# Altium project RK_MEGAPLATA.PrjPcb (part 2 of 9)

## Sheet RK3588_TYPE_C.SchDoc
size 594 x 420 mm; SheetNumber: 6; SheetTotal: 23
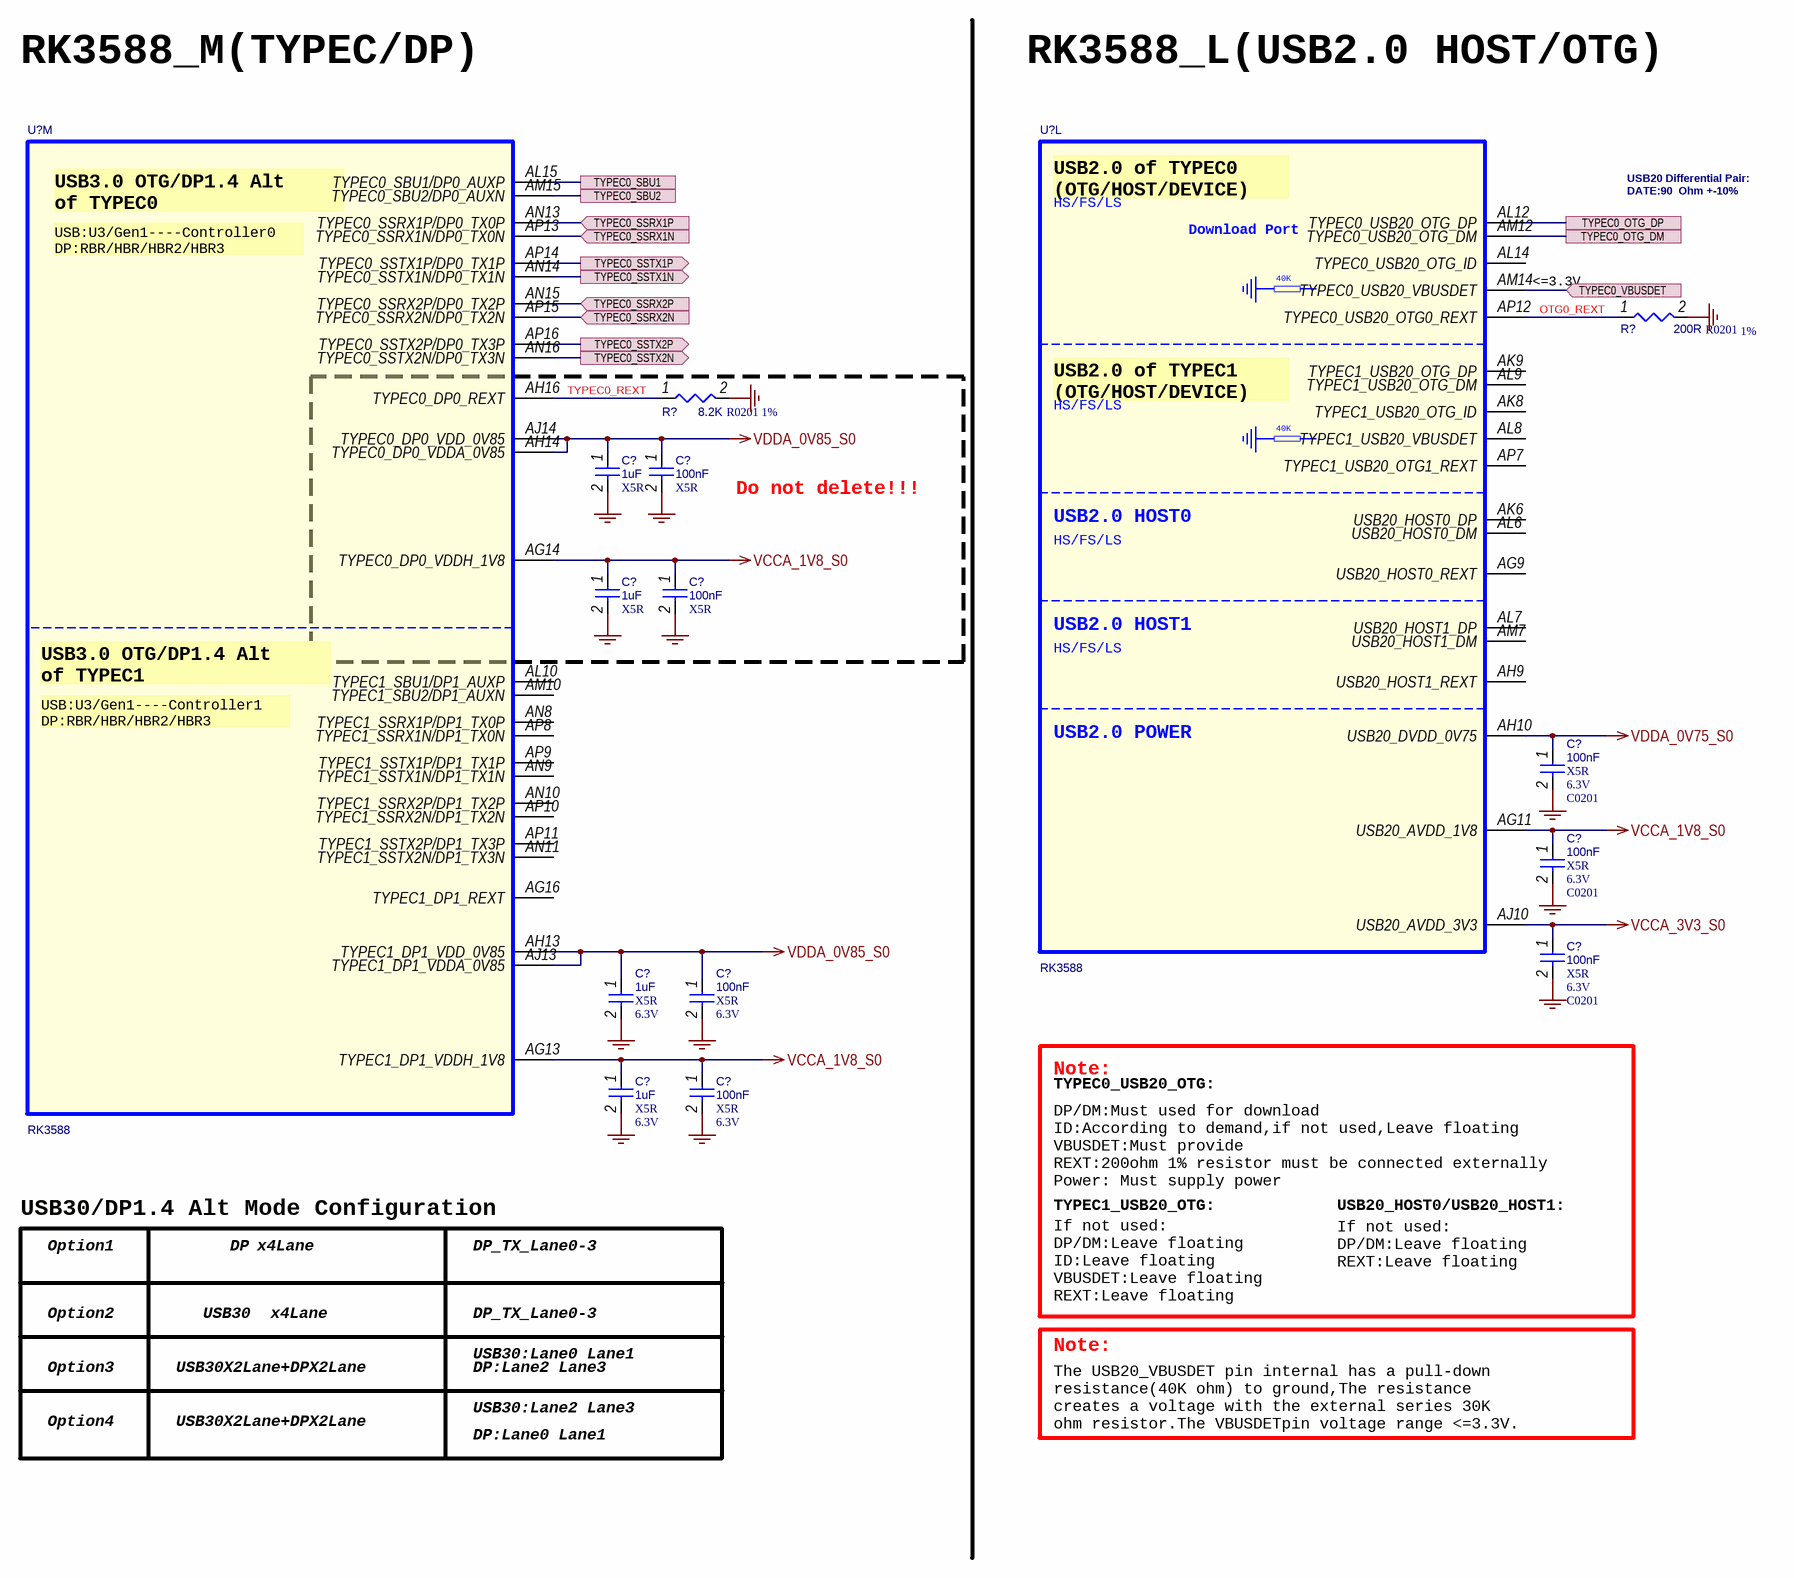
[diagram p7: RK3588_TYPE_C.SchDoc]

### Parts
(Parts that share a designator on the sheet are numbered #1, #2 ... from top to bottom, then left to right.)
C?#48  1uF  Dielectric: X5R  [C0201]
C?#49  100nF  Dielectric: X5R  [C0201]
C?#50  1uF  Dielectric: X5R  [C0201]
C?#51  100nF  Dielectric: X5R  [C0201]
C?#52  100nF  Dielectric: X5R  Voltage: 6.3V  [C0201]
C?#53  100nF  Dielectric: X5R  Voltage: 6.3V  [C0201]
C?#54  100nF  Dielectric: X5R  Voltage: 6.3V  [C0201]
C?#55  1uF  Dielectric: X5R  Voltage: 6.3V  [C0201]
C?#56  100nF  Dielectric: X5R  Voltage: 6.3V  [C0201]
C?#57  1uF  Dielectric: X5R  Voltage: 6.3V  [C0201]
C?#58  100nF  Dielectric: X5R  Voltage: 6.3V  [C0201]
R?#22  200R  Tolerance: 1%  PCB Footprint: R0201  [R0402]
R?#23  8.2K  Tolerance: 1%  PCB Footprint: R0201  [R0402]
U?#7  RK3588  [BGA1088_23R00X23R00X2R00]  (part M of 26)
U?#8  RK3588  [BGA1088_23R00X23R00X2R00]  (part L of 26)

### Blocks framed on the sheet
Do not delete!!!: C?#48-C?#51 R?#23 U?#7

### Ports
TYPEC0_OTG_DM (see PORT_TYPE_C[2B]), TYPEC0_OTG_DP (see PORT_TYPE_C[2B]), TYPEC0_SBU1 (see PORT_TYPE_C[2A]), TYPEC0_SBU2 (see PORT_TYPE_C[2B]), TYPEC0_SSRX1N (in, see PORT_TYPE_C[2B]), TYPEC0_SSRX1P (in, see PORT_TYPE_C[2B]), TYPEC0_SSRX2N (in, see PORT_TYPE_C[2B]), TYPEC0_SSRX2P (in, see PORT_TYPE_C[2B]), TYPEC0_SSTX1N (out, see PORT_TYPE_C[2B]), TYPEC0_SSTX1P (out, see PORT_TYPE_C[2B]), TYPEC0_SSTX2N (out, see PORT_TYPE_C[2B]), TYPEC0_SSTX2P (out, see PORT_TYPE_C[2B]), TYPEC0_VBUSDET (in, see PORT_TYPE_C[2C])

### Nets
GND: C?#48.2 C?#49.2 C?#50.2 C?#51.2 C?#52.2 C?#53.2 C?#54.2 C?#55.2 C?#56.2 C?#57.2 C?#58.2 R?#22.2 R?#23.2
VCCA_1V8_S0: C?#50.1 C?#51.1 C?#53.1 C?#57.1 C?#58.1 U?#7.AG13(TYPEC1_DP1_VDDH_1V8) U?#7.AG14(TYPEC0_DP0_VDDH_1V8) U?#8.AG11(USB20_AVDD_1V8)
VCCA_3V3_S0: C?#54.1 U?#8.AJ10(USB20_AVDD_3V3)
VDDA_0V75_S0: C?#52.1 U?#8.AH10(USB20_DVDD_0V75)
VDDA_0V85_S0: C?#48.1 C?#49.1 C?#55.1 C?#56.1 U?#7.AH13(TYPEC1_DP1_VDD_0V85) U?#7.AH14(TYPEC0_DP0_VDDA_0V85) U?#7.AJ13(TYPEC1_DP1_VDDA_0V85) U?#7.AJ14(TYPEC0_DP0_VDD_0V85)
OTG0_REXT: R?#22.1 U?#8.AP12(TYPEC0_USB20_OTG0_REXT)
TYPEC0_REXT: R?#23.1 U?#7.AH16(TYPEC0_DP0_REXT)
NetC?#185_1: U?#7.AL15(TYPEC0_SBU1/DP0_AUXP) ; port TYPEC0_SBU1
NetC?#186_1: U?#7.AM15(TYPEC0_SBU2/DP0_AUXN) ; port TYPEC0_SBU2
NetC?#187_1: U?#7.AN14(TYPEC0_SSTX1N/DP0_TX1N) ; port TYPEC0_SSTX1N
NetC?#188_1: U?#7.AP14(TYPEC0_SSTX1P/DP0_TX1P) ; port TYPEC0_SSTX1P
NetC?#189_1: U?#7.AN16(TYPEC0_SSTX2N/DP0_TX3N) ; port TYPEC0_SSTX2N
NetC?#190_1: U?#7.AP16(TYPEC0_SSTX2P/DP0_TX3P) ; port TYPEC0_SSTX2P
NetR?#73_1: U?#8.AM12(TYPEC0_USB20_OTG_DM) ; port TYPEC0_OTG_DM
NetR?#75_1: U?#8.AL12(TYPEC0_USB20_OTG_DP) ; port TYPEC0_OTG_DP
NetR?#77_1: U?#7.AP13(TYPEC0_SSRX1N/DP0_TX0N) ; port TYPEC0_SSRX1N
NetR?#78_1: U?#7.AN13(TYPEC0_SSRX1P/DP0_TX0P) ; port TYPEC0_SSRX1P
NetR?#79_1: U?#7.AP15(TYPEC0_SSRX2N/DP0_TX2N) ; port TYPEC0_SSRX2N
NetR?#80_1: U?#7.AN15(TYPEC0_SSRX2P/DP0_TX2P) ; port TYPEC0_SSRX2P
NetR?#81_1: U?#8.AM14(TYPEC0_USB20_VBUSDET) ; port TYPEC0_VBUSDET

Not connected (* = marked no-connect by the designer): U?#7 AG16(TYPEC1_DP1_REXT) AL10(TYPEC1_SBU1/DP1_AUXP) AM10(TYPEC1_SBU2/DP1_AUXN) AN8(TYPEC1_SSRX1P/DP1_TX0P) AN9(TYPEC1_SSTX1N/DP1_TX1N) AN10(TYPEC1_SSRX2P/DP1_TX2P) AN11(TYPEC1_SSTX2N/DP1_TX3N) AP8(TYPEC1_SSRX1N/DP1_TX0N) AP9(TYPEC1_SSTX1P/DP1_TX1P) AP10(TYPEC1_SSRX2N/DP1_TX2N) AP11(TYPEC1_SSTX2P/DP1_TX3P); U?#8 AG9(USB20_HOST0_REXT) AH9(USB20_HOST1_REXT) AK6(USB20_HOST0_DP) AK8(TYPEC1_USB20_OTG_ID) AK9(TYPEC1_USB20_OTG_DP) AL6(USB20_HOST0_DM) AL7(USB20_HOST1_DP) AL8(TYPEC1_USB20_VBUSDET) AL9(TYPEC1_USB20_OTG_DM) AL14(TYPEC0_USB20_OTG_ID) AM7(USB20_HOST1_DM) AP7(TYPEC1_USB20_OTG1_REXT)

### Notes on the sheet
- RK3588_M(TYPEC/DP)
- RK3588_L(USB2.0 HOST/OTG)
- USB20 Differential Pair:
  DATE:90  Ohm +-10%
- <=3.3V
- Note:
- TYPEC0_USB20_OTG:
- TYPEC1_USB20_OTG:
- DP/DM:Must used for download
  ID:According to demand,if not used,Leave floating
  VBUSDET:Must provide
  REXT:200ohm 1% resistor must be connected externally
  Power: Must supply power
- USB20_HOST0/USB20_HOST1:
- USB30/DP1.4 Alt Mode Configuration
- Option1
- DP
- x4Lane
- DP_TX_Lane0-3
- If not used:
  DP/DM:Leave floating
  REXT:Leave floating
- Option2
- USB30
- If not used:
  DP/DM:Leave floating
  ID:Leave floating
  VBUSDET:Leave floating
  REXT:Leave floating
- Option3
- USB30X2Lane+DPX2Lane
- USB30:Lane0 Lane1
- DP:Lane2 Lane3
- Option4
- USB30:Lane2 Lane3
- DP:Lane0 Lane1
- The USB20_VBUSDET pin internal has a pull-down
  resistance(40K ohm) to ground,The resistance
  creates a voltage with the external series 30K
  ohm resistor.The VBUSDETpin voltage range <=3.3V.
- 420x594
- Формат А2
- (in symbol SOC_RK3588, part L) USB2.0 of TYPEC0 / (OTG/HOST/DEVICE); HS/FS/LS; Download Port; 40K; USB2.0 of TYPEC1 / (OTG/HOST/DEVICE); USB2.0 HOST0; USB2.0 HOST1; USB2.0 POWER
- (in symbol SOC_RK3588, part M) USB3.0 OTG/DP1.4 Alt / of TYPEC0; USB:U3/Gen1----Controller0 / DP:RBR/HBR/HBR2/HBR3; USB3.0 OTG/DP1.4 Alt / of TYPEC1; USB:U3/Gen1----Controller1 / DP:RBR/HBR/HBR2/HBR3

### Library data of the parts
C?#48 = CAP NP_Dup1: cap,1.00uF,+/-20%,6.3V,X5R,C0201; Part Reference: C1400; Manufacturer: TDK; RK PN: C0603X5R0J105M030BC; Priority: A; Tolerance: 20%; Value: 1uF; Part Type: C0201; Manufacturer PN: C0603X5R0J105M030BC; Created by: JJJ
C?#49 = CAP NP_Dup1: cap,100.00nF,+/-10%,6.3V,X5R,C0201; Part Reference: C1401; Manufacturer: TDK; RK PN: C0603X5R0J104K030BC; Priority: A; Tolerance: 10%; Value: 100nF; Part Type: C0201; Manufacturer PN: C0603X5R0J104K030BC; Created by: JJJ
C?#50 = CAP NP_Dup1: cap,1.00uF,+/-20%,6.3V,X5R,C0201; Part Reference: C1402; Manufacturer: TDK; RK PN: C0603X5R0J105M030BC; Priority: A; Tolerance: 20%; Value: 1uF; Part Type: C0201; Manufacturer PN: C0603X5R0J105M030BC; Created by: JJJ
C?#51 = CAP NP_Dup1: cap,100.00nF,+/-10%,6.3V,X5R,C0201; Part Reference: C1403; Manufacturer: TDK; RK PN: C0603X5R0J104K030BC; Priority: A; Tolerance: 10%; Value: 100nF; Part Type: C0201; Manufacturer PN: C0603X5R0J104K030BC; Created by: JJJ
C?#52 = CAP NP_Dup1: cap,100.00nF,+/-10%,6.3V,X5R,C0201; Part Reference: C1408; Manufacturer PN: C0603X5R0J104K030BC; Manufacturer: TDK; Tolerance: 10%; Priority: A; PCB Footprint: C0201; Value: 100nF; Created by: JJJ; Part Type: C0201; RK PN: C0603X5R0J104K030BC
C?#53 = CAP NP_Dup1: cap,100.00nF,+/-10%,6.3V,X5R,C0201; Part Reference: C1409; Manufacturer PN: C0603X5R0J104K030BC; Manufacturer: TDK; Tolerance: 10%; Priority: A; PCB Footprint: C0201; Value: 100nF; Created by: JJJ; Part Type: C0201; RK PN: C0603X5R0J104K030BC
C?#54 = CAP NP_Dup1: cap,100.00nF,+/-10%,6.3V,X5R,C0201; Part Reference: C1410; Manufacturer PN: C0603X5R0J104K030BC; Manufacturer: TDK; Tolerance: 10%; Priority: A; PCB Footprint: C0201; Value: 100nF; Created by: JJJ; Part Type: C0201; RK PN: C0603X5R0J104K030BC
C?#55 = CAP NP_Dup1: cap,1.00uF,+/-20%,6.3V,X5R,C0201; Part Reference: C1404; Manufacturer PN: C0603X5R0J105M030BC; Manufacturer: TDK; Tolerance: 20%; Priority: A; Value: 1uF; Created by: JJJ; Part Type: C0201; RK PN: C0603X5R0J105M030BC
C?#56 = CAP NP_Dup1: cap,100.00nF,+/-10%,6.3V,X5R,C0201; Part Reference: C1405; Manufacturer: TDK; RK PN: C0603X5R0J104K030BC; Priority: A; Tolerance: 10%; Value: 100nF; Part Type: C0201; Manufacturer PN: C0603X5R0J104K030BC; Created by: JJJ
C?#57 = CAP NP_Dup1: cap,1.00uF,+/-20%,6.3V,X5R,C0201; Part Reference: C1406; Manufacturer PN: C0603X5R0J105M030BC; Manufacturer: TDK; Tolerance: 20%; Priority: A; Value: 1uF; Created by: JJJ; Part Type: C0201; RK PN: C0603X5R0J105M030BC
C?#58 = CAP NP_Dup1: cap,100.00nF,+/-10%,6.3V,X5R,C0201; Part Reference: C1407; Manufacturer PN: C0603X5R0J104K030BC; Manufacturer: TDK; Tolerance: 10%; Priority: A; Value: 100nF; Created by: JJJ; Part Type: C0201; RK PN: C0603X5R0J104K030BC
R?#22 = RESISTOR_Dup2: НЁУГєсД¤µзЧи,200R,+/-1%,R0201,1/20W.; Part Reference: R1405; Manufacturer PN: RC0201FR-07200RL; Manufacturer: YAGEO; Wattage: 1/20W; Priority: A; Value: 200R; Created by: YTL; Part Type: НЁУГєсД¤µзЧи; RK PN: RC0201FR-07200RL
R?#23 = RESISTOR_Dup2: НЁУГєсД¤µзЧи,8K2,+/-1%,R0201,1/20W.; Part Reference: R1402; Manufacturer: YAGEO; RK PN: RC0201FR-078K2L; Priority: A; Wattage: 1/20W; Value: 8.2K; Part Type: НЁУГєсД¤µзЧи; Manufacturer PN: RC0201FR-078K2L; Created by: YTL
U?#7 U?#8 = SOC_RK3588: as U?#1 on sheet RK3588_OSC_PLL; Value: RK3588; PCB Footprint: BGA1088_23R00X23R00X2R00; Created by: YWQ; Manufacturer PN: RK3588; Part Type: SOC; RK PN: RK3588

## Sheet RK3588_BOOTLOADER_MAYBE_SDIO.SchDoc
size 594 x 420 mm; SheetNumber: 7; SheetTotal: 23
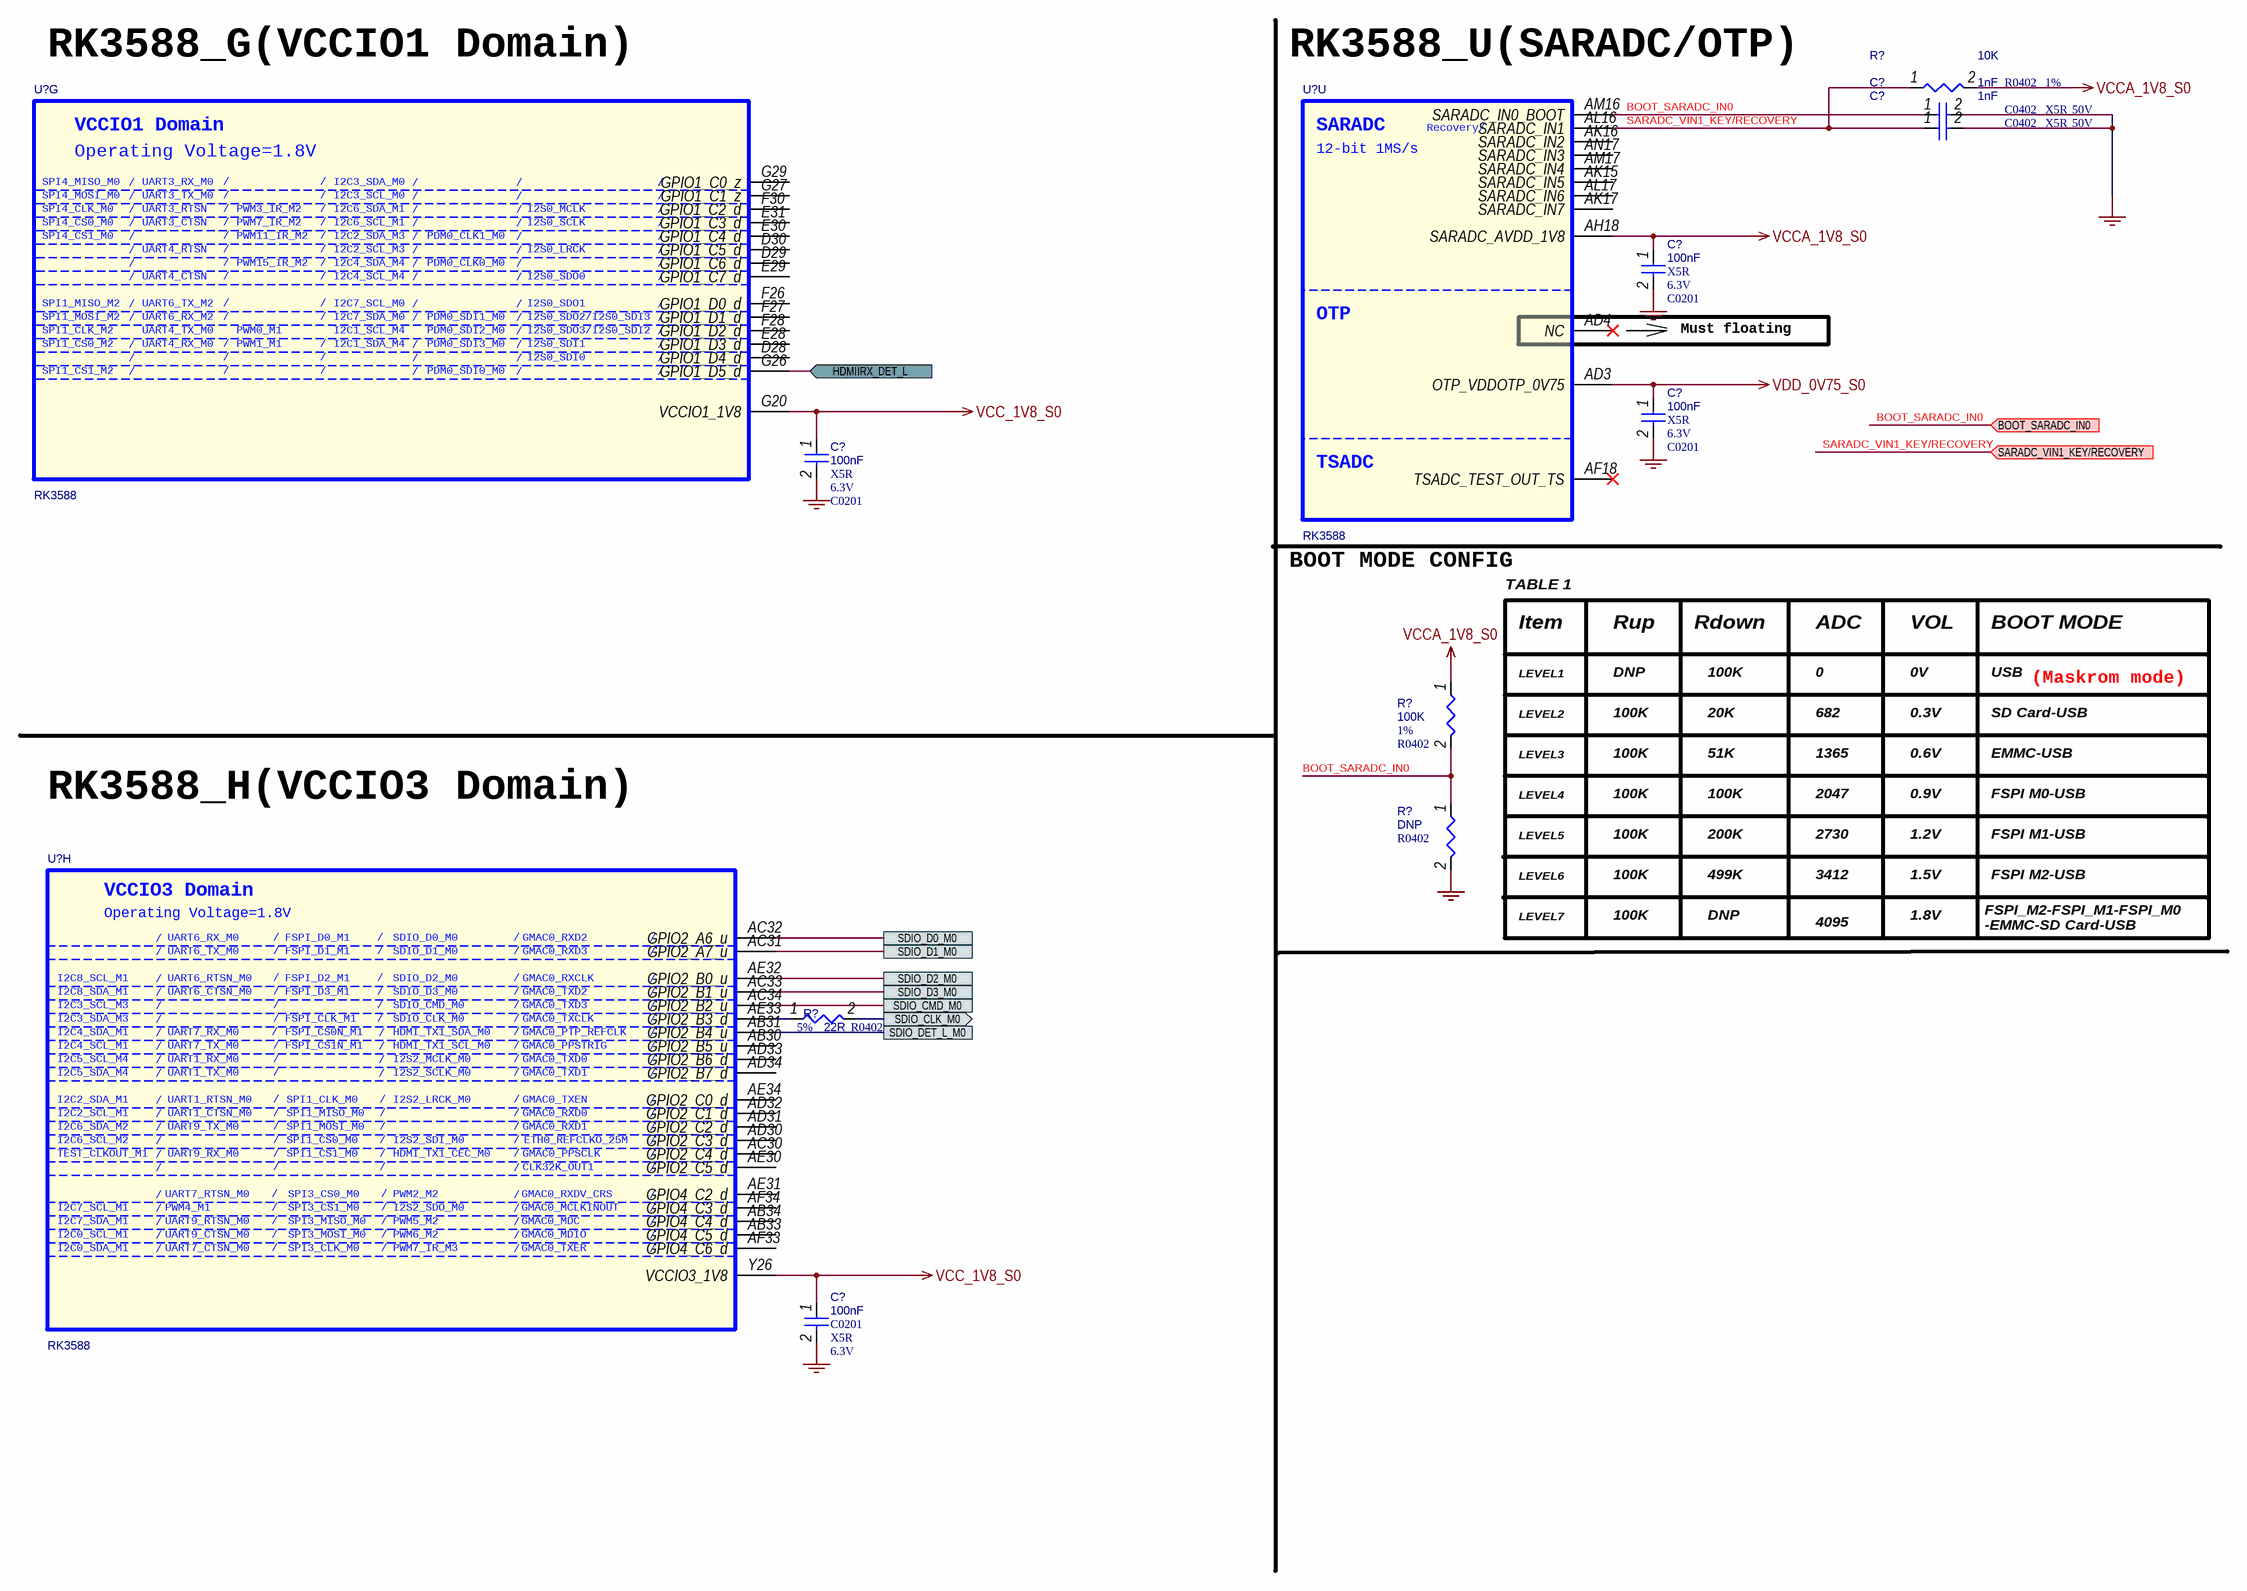
[diagram p8: RK3588_BOOTLOADER_MAYBE_SDIO.SchDoc]

### Parts
(Parts that share a designator on the sheet are numbered #1, #2 ... from top to bottom, then left to right.)
C?#59  1nF  Dielectric: X5R  Voltage: 50V  [C0402]
C?#60  1nF  Dielectric: X5R  Voltage: 50V  [C0402]
C?#61  100nF  Dielectric: X5R  Voltage: 6.3V  [C0201]
C?#62  100nF  Dielectric: X5R  Voltage: 6.3V  [C0201]
C?#63  100nF  Dielectric: X5R  Voltage: 6.3V  [C0201]
C?#64  100nF  Dielectric: X5R  Voltage: 6.3V  [C0201]
R?#24  10K  Tolerance: 1%  [R0402]
R?#25  100K  Tolerance: 1%  [R0402]
R?#26  DNP  [R0402]
R?#27  22R  Tolerance: 5%  [R0402]
U?#9  RK3588  [BGA1088_23R00X23R00X2R00]  (part G of 26)
U?#10  RK3588  [BGA1088_23R00X23R00X2R00]  (part U of 26)
U?#11  RK3588  [BGA1088_23R00X23R00X2R00]  (part H of 26)

### Ports
BOOT_SARADC_IN0 (in, see BUTTON[1C]), HDMIIRX_DET_L (in, see HDMI2_0_RX[4C]), SARADC_VIN1_KEY/RECOVERY (in, see BUTTON[1A]), SDIO_CLK_M0 (out, see SD_CARD_SDIO[2B]), SDIO_CMD_M0 (see SD_CARD_SDIO[2B]), SDIO_D0_M0 (see SD_CARD_SDIO[2B]), SDIO_D1_M0 (see SD_CARD_SDIO[2B]), SDIO_D2_M0 (see SD_CARD_SDIO[2B]), SDIO_D3_M0 (see SD_CARD_SDIO[2B]), SDIO_DET_L_M0 (see SD_CARD_SDIO[2B])

### Nets
GND: C?#59.2 C?#60.2 C?#61.2 C?#62.2 C?#63.2 C?#64.2 R?#26.2
VCC_1V8_S0: C?#63.1 C?#64.1 U?#9.G20(VCCIO1_1V8) U?#11.Y26(VCCIO3_1V8)
VCCA_1V8_S0: C?#61.1 R?#24.2 R?#25.1 U?#10.AH18(SARADC_AVDD_1V8)
VDD_0V75_S0: C?#62.1 U?#10.AD3(OTP_VDDOTP_0V75)
BOOT_SARADC_IN0: C?#59.1 R?#25.2 R?#26.1 U?#10.AM16(SARADC_IN0_BOOT) ; port BOOT_SARADC_IN0
HDMIIRX_DET_L: U?#9.G26(GPIO1_D5_d) ; port HDMIIRX_DET_L
SARADC_VIN1_KEY/RECOVERY: C?#60.1 R?#24.1 U?#10.AL16(SARADC_IN1) ; port SARADC_VIN1_KEY/RECOVERY
NetD?#10_1: U?#11.AE32(GPIO2_B0_u) ; port SDIO_D2_M0
NetD?#11_1: U?#11.AC33(GPIO2_B1_u) ; port SDIO_D3_M0
NetD?#12_1: U?#11.AC34(GPIO2_B2_u) ; port SDIO_CMD_M0
NetD?#13_1: R?#27.2 ; port SDIO_CLK_M0
NetD?#14_1: U?#11.AC32(GPIO2_A6_u) ; port SDIO_D0_M0
NetD?#15_1: U?#11.AC31(GPIO2_A7_u) ; port SDIO_D1_M0
NetD?#16_1: U?#11.AB31(GPIO2_B4_u) ; port SDIO_DET_L_M0
NetR?#27_1: R?#27.1 U?#11.AE33(GPIO2_B3_d)

Not connected (* = marked no-connect by the designer): U?#9 D28(GPIO1_D4_d) D29(GPIO1_C6_d) D30(GPIO1_C5_d) E28(GPIO1_D3_d) E29(GPIO1_C7_d) E30(GPIO1_C4_d) E31(GPIO1_C3_d) F26(GPIO1_D0_d) F27(GPIO1_D1_d) F28(GPIO1_D2_d) F30(GPIO1_C2_d) G27(GPIO1_C1_z) G29(GPIO1_C0_z); U?#10 AD4(NC)* AF18(TSADC_TEST_OUT_TS)* AK15(SARADC_IN5) AK16(SARADC_IN2) AK17(SARADC_IN7) AL17(SARADC_IN6) AM17(SARADC_IN4) AN17(SARADC_IN3); U?#11 AB30(GPIO2_B5_u) AB33(GPIO4_C5_d) AB34(GPIO4_C4_d) AC30(GPIO2_C4_d) AD30(GPIO2_C3_d) AD31(GPIO2_C2_d) AD32(GPIO2_C1_d) AD33(GPIO2_B6_d) AD34(GPIO2_B7_d) AE30(GPIO2_C5_d) AE31(GPIO4_C2_d) AE34(GPIO2_C0_d) AF33(GPIO4_C6_d) AF34(GPIO4_C3_d)

### Notes on the sheet
- RK3588_G(VCCIO1 Domain)
- (near U?#10) RK3588_U(SARADC/OTP)
- (near C?#61) Must floating
- BOOT MODE CONFIG
- TABLE 1
- LEVEL1
- Item
- Rup
- DNP
- Rdown
- 100K
- ADC
- 0
- VOL
- 0V
- BOOT MODE
- USB
- LEVEL2
- 20K
- 682
- 0.3V
- SD Card-USB
- (Maskrom mode)
- RK3588_H(VCCIO3 Domain)
- LEVEL3
- LEVEL4
- 51K
- 1365
- 2047
- 0.9V
- 0.6V
- EMMC-USB
- FSPI M0-USB
- LEVEL5
- 200K
- 2730
- 1.2V
- FSPI M1-USB
- LEVEL6
- LEVEL7
- 499K
- 3412
- 4095
- 1.8V
- 1.5V
- FSPI_M2-FSPI_M1-FSPI_M0
  -EMMC-SD Card-USB
- FSPI M2-USB
- 420x594
- Формат А2
- (in symbol SOC_RK3588, part G) VCCIO1 Domain; Operating Voltage=1.8V; SPI4_MISO_M0; /; UART3_RX_M0; I2C3_SDA_M0; SPI4_MOSI_M0; UART3_TX_M0; I2C3_SCL_M0; SPI4_CLK_M0; UART3_RTSN; PWM3_IR_M2; I2C6_SDA_M1; I2S0_MCLK; SPI4_CS0_M0; UART3_CTSN; PWM7_IR_M2; I2C6_SCL_M1; I2S0_SCLK; SPI4_CS1_M0; PWM11_IR_M2; I2C2_SDA_M3; PDM0_CLK1_M0; UART4_RTSN; I2C2_SCL_M3; I2S0_LRCK; PWM15_IR_M2; I2C4_SDA_M4; PDM0_CLK0_M0; UART4_CTSN; I2C4_SCL_M4; I2S0_SDO0; SPI1_MISO_M2; UART6_TX_M2; I2C7_SCL_M0; I2S0_SDO1; SPI1_MOSI_M2; UART6_RX_M2; I2C7_SDA_M0; PDM0_SDI1_M0; I2S0_SDO2/I2S0_SDI3; SPI1_CLK_M2; UART4_TX_M0; PWM0_M1; I2C1_SCL_M4; PDM0_SDI2_M0; I2S0_SDO3/I2S0_SDI2; SPI1_CS0_M2; UART4_RX_M0; PWM1_M1; I2C1_SDA_M4; PDM0_SDI3_M0; I2S0_SDI1; I2S0_SDI0; SPI1_CS1_M2; PDM0_SDI0_M0
- (in symbol SOC_RK3588, part H) VCCIO3 Domain; Operating Voltage=1.8V; /; UART6_RX_M0; FSPI_D0_M1; SDIO_D0_M0; GMAC0_RXD2; UART6_TX_M0; FSPI_D1_M1; SDIO_D1_M0; GMAC0_RXD3; I2C8_SCL_M1; UART6_RTSN_M0; FSPI_D2_M1; SDIO_D2_M0; GMAC0_RXCLK; I2C8_SDA_M1; UART6_CTSN_M0; FSPI_D3_M1; SDIO_D3_M0; GMAC0_TXD2; I2C3_SCL_M3; SDIO_CMD_M0; GMAC0_TXD3; I2C3_SDA_M3; FSPI_CLK_M1; SDIO_CLK_M0; GMAC0_TXCLK; I2C4_SDA_M1; UART7_RX_M0; FSPI_CS0N_M1; HDMI_TX1_SDA_M0; GMAC0_PTP_REFCLK; I2C4_SCL_M1; UART7_TX_M0; FSPI_CS1N_M1; HDMI_TX1_SCL_M0; GMAC0_PPSTRIG; I2C5_SCL_M4; UART1_RX_M0; I2S2_MCLK_M0; GMAC0_TXD0; I2C5_SDA_M4; UART1_TX_M0; I2S2_SCLK_M0; GMAC0_TXD1; I2C2_SDA_M1; UART1_RTSN_M0; SPI1_CLK_M0; I2S2_LRCK_M0; GMAC0_TXEN; I2C2_SCL_M1; UART1_CTSN_M0; SPI1_MISO_M0; GMAC0_RXD0; I2C6_SDA_M2; UART9_TX_M0; SPI1_MOSI_M0; GMAC0_RXD1; I2C6_SCL_M2; SPI1_CS0_M0; I2S2_SDI_M0; ETH0_REFCLKO_25M; TEST_CLKOUT_M1; UART9_RX_M0; SPI1_CS1_M0; HDMI_TX1_CEC_M0; GMAC0_PPSCLK; CLK32K_OUT1; UART7_RTSN_M0; SPI3_CS0_M0; PWM2_M2; GMAC0_RXDV_CRS; I2C7_SCL_M1; PWM4_M1; SPI3_CS1_M0; I2S2_SDO_M0; GMAC0_MCLKINOUT; I2C7_SDA_M1; UART9_RTSN_M0; SPI3_MISO_M0; PWM5_M2; GMAC0_MDC; I2C0_SCL_M1; UART9_CTSN_M0; SPI3_MOSI_M0; PWM6_M2; GMAC0_MDIO; I2C0_SDA_M1; UART7_CTSN_M0; SPI3_CLK_M0; PWM7_IR_M3; GMAC0_TXER
- (in symbol SOC_RK3588, part U) SARADC; Recovery/; 12-bit 1MS/s; OTP; TSADC

### Library data of the parts
C?#59 = CAP NP_Dup1: cap,1.00nF,+/-10%,50V,X5R,C0402; Part Reference: C1510; Manufacturer: TDK; RK PN: C1005X5R1H102K050BA; Priority: A; Tolerance: 10%; PCB Footprint: C0402; Value: 1nF; Part Type: C0402; Manufacturer PN: C1005X5R1H102K050BA; Created by: JJJ
C?#60 = CAP NP_Dup1: cap,1.00nF,+/-10%,50V,X5R,C0402; Part Reference: C1511; Manufacturer: TDK; RK PN: C1005X5R1H102K050BA; Priority: A; Tolerance: 10%; PCB Footprint: C0402; Value: 1nF; Part Type: C0402; Manufacturer PN: C1005X5R1H102K050BA; Created by: JJJ
C?#61 = CAP NP_Dup1: cap,100.00nF,+/-10%,6.3V,X5R,C0201; Part Reference: C1501; Manufacturer: TDK; RK PN: C0603X5R0J104K030BC; Priority: A; Tolerance: 10%; PCB Footprint: C0201; Value: 100nF; Part Type: C0201; Manufacturer PN: C0603X5R0J104K030BC; Created by: JJJ
C?#62 = CAP NP_Dup1: cap,100.00nF,+/-10%,6.3V,X5R,C0201; Part Reference: C1505; Manufacturer PN: C0603X5R0J104K030BC; Manufacturer: TDK; Tolerance: 10%; Priority: A; PCB Footprint: C0201; Value: 100nF; Created by: JJJ; Part Type: C0201; RK PN: C0603X5R0J104K030BC
C?#63 = CAP NP_Dup1: cap,100.00nF,+/-10%,6.3V,X5R,C0201; Part Reference: C1502; Manufacturer: TDK; RK PN: C0603X5R0J104K030BC; Priority: A; Tolerance: 10%; PCB Footprint: C0201; Value: 100nF; Part Type: C0201; Manufacturer PN: C0603X5R0J104K030BC; Created by: JJJ
C?#64 = CAP NP_Dup1: cap,100.00nF,+/-10%,6.3V,X5R,C0201; Part Reference: C1503; Manufacturer: TDK; RK PN: C0603X5R0J104K030BC; Priority: A; Tolerance: 10%; PCB Footprint: C0201; Value: 100nF; Part Type: C0201; Manufacturer PN: C0603X5R0J104K030BC; Created by: JJJ
R?#24 = RESISTOR_Dup2: НЁУГєсД¤µзЧи,10K,+/-1%,R0402,1/16W.; Part Reference: R1500; Manufacturer: YAGEO; RK PN: RC0402FR-0710KL; Priority: A; Wattage: 1/16W; PCB Footprint: R0402; Value: 10K; Part Type: НЁУГєсД¤µзЧи; Manufacturer PN: RC0402FR-0710KL; Created by: YTL
R?#25 = RESISTOR_Dup2: НЁУГєсД¤µзЧи,100K,+/-1%,R0402,1/16W.; Part Reference: R1511; Manufacturer: YAGEO; RK PN: RC0402FR-07100KL; Priority: A; Wattage: 1/16W; PCB Footprint: R0402; Value: 100K; Part Type: НЁУГєсД¤µзЧи; Manufacturer PN: RC0402FR-07100KL; Created by: YTL
R?#26 = RESISTOR_Dup2: Did Not Place.; Part Reference: R1509; RK PN: DNPR0402; Priority: A; PCB Footprint: R0402; Value: DNP; Part Type: DNP; Manufacturer PN: DNPR0402; Created by: JJJ
R?#27 = RESISTOR_Dup2: НЁУГєсД¤µзЧи,22R,+/-5%,R0402,1/16W.; Part Reference: R1320; Manufacturer PN: RC0402JR-0722RL; Manufacturer: YAGEO; Wattage: 1/16W; Priority: A; PCB Footprint: R0402; Value: 22R; Created by: YTL; Part Type: НЁУГєсД¤µзЧи; RK PN: RC0402JR-0722RL
U?#9-U?#11 = SOC_RK3588: ROCKCHIP SOC; Part Reference: U1000; Manufacturer: Rockchip (ИрРѕОў); SWAP_INFO: (S1+S2+S3+S4+S5+S6+S7+S8+S9+S10+S11+S12+S13+S14+S15+S16+S17+S18+S19+S20+S21+S22+S23+S24+S25+S26); SPLIT_INST: TRUE; Priority: A; Value: RK3588; PCB Footprint: BGA1088_23R00X23R00X2R00; Created by: YWQ; Manufacturer PN: RK3588; Part Type: SOC; RK PN: RK3588

## Sheet RK3588_MIPI.SchDoc
size 594 x 420 mm; SheetNumber: 8; SheetTotal: 23
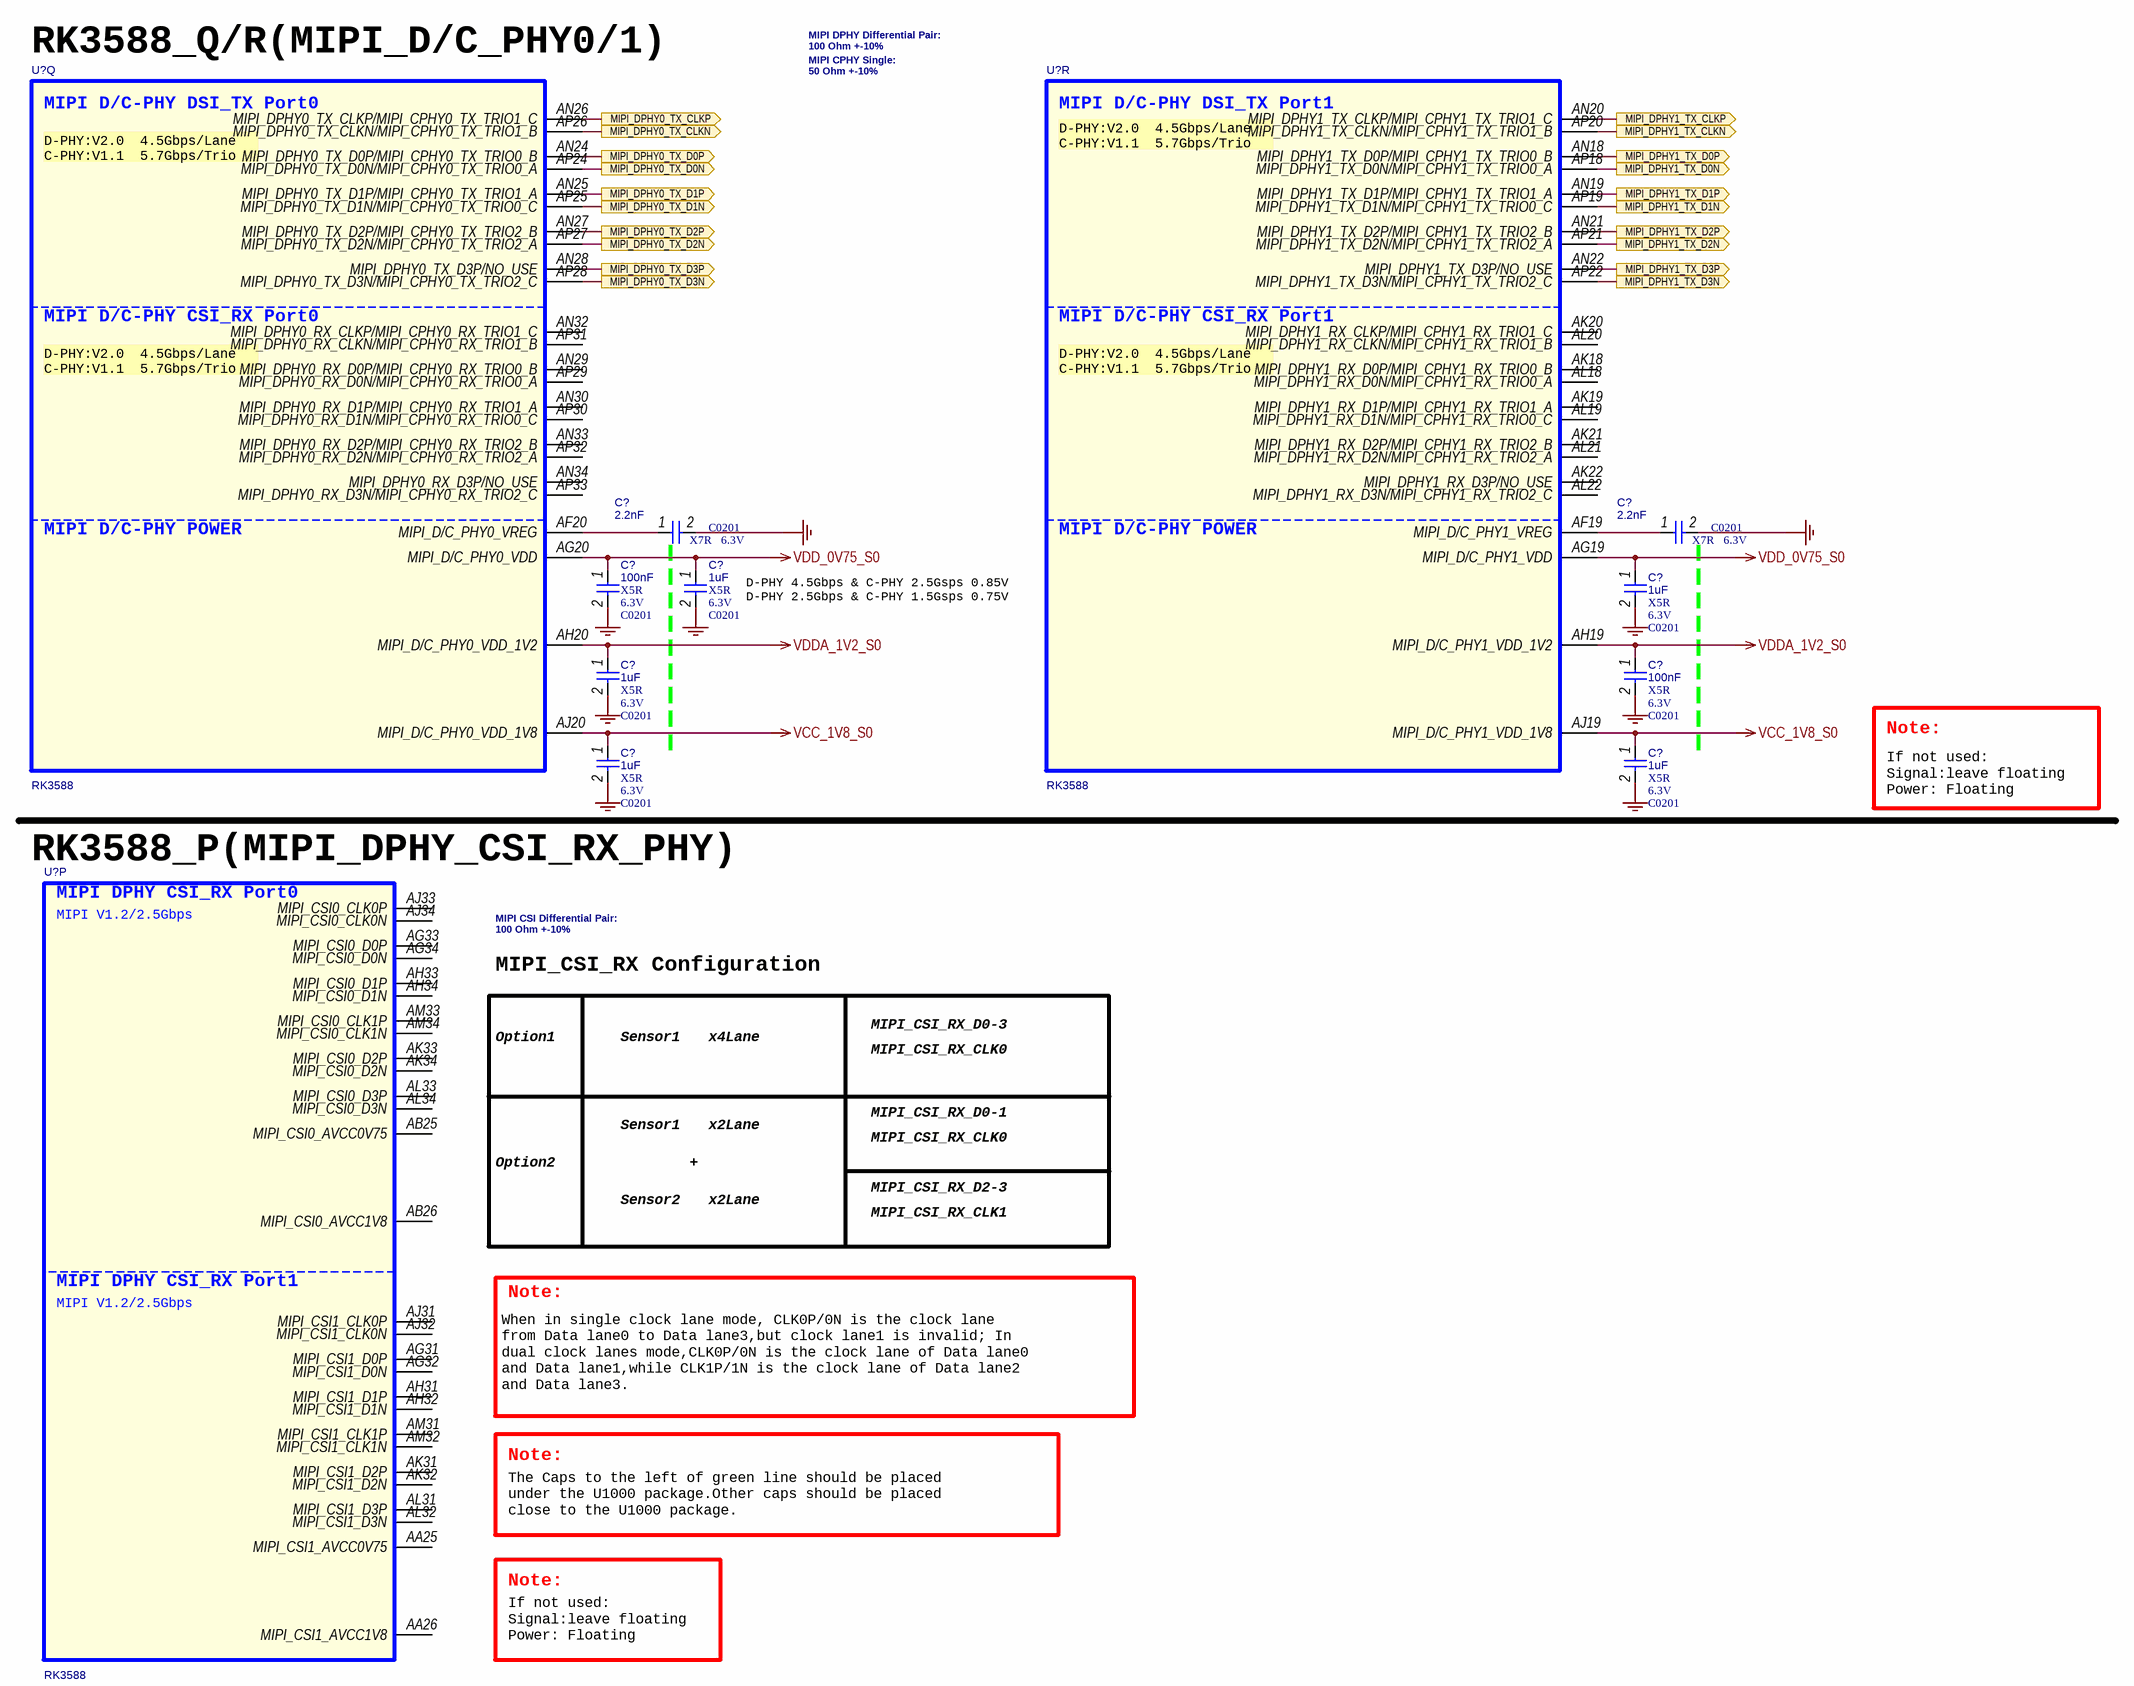
[diagram p9: RK3588_MIPI.SchDoc]

### Parts
(Parts that share a designator on the sheet are numbered #1, #2 ... from top to bottom, then left to right.)
C?#65  2.2nF  Dielectric: X7R  Voltage: 6.3V  [C0201]
C?#66  2.2nF  Dielectric: X7R  Voltage: 6.3V  [C0201]
C?#67  100nF  Dielectric: X5R  Voltage: 6.3V  [C0201]
C?#68  1uF  Dielectric: X5R  Voltage: 6.3V  [C0201]
C?#69  1uF  Dielectric: X5R  Voltage: 6.3V  [C0201]
C?#70  1uF  Dielectric: X5R  Voltage: 6.3V  [C0201]
C?#71  100nF  Dielectric: X5R  Voltage: 6.3V  [C0201]
C?#72  1uF  Dielectric: X5R  Voltage: 6.3V  [C0201]
C?#73  1uF  Dielectric: X5R  Voltage: 6.3V  [C0201]
U?#12  RK3588  [BGA1088_23R00X23R00X2R00]  (part Q of 26)
U?#13  RK3588  [BGA1088_23R00X23R00X2R00]  (part R of 26)
U?#14  RK3588  [BGA1088_23R00X23R00X2R00]  (part P of 26)

### Ports
MIPI_DPHY0_TX_CLKN (out, see MIPI_D_CPHY_TX_DUAL[2A]), MIPI_DPHY0_TX_CLKP (out, see MIPI_D_CPHY_TX_DUAL[2A]), MIPI_DPHY0_TX_D0N (out, see MIPI_D_CPHY_TX_DUAL[2A]), MIPI_DPHY0_TX_D0P (out, see MIPI_D_CPHY_TX_DUAL[2A]), MIPI_DPHY0_TX_D1N (out, see MIPI_D_CPHY_TX_DUAL[2B]), MIPI_DPHY0_TX_D1P (out, see MIPI_D_CPHY_TX_DUAL[2A]), MIPI_DPHY0_TX_D2N (out, see MIPI_D_CPHY_TX_DUAL[2B]), MIPI_DPHY0_TX_D2P (out, see MIPI_D_CPHY_TX_DUAL[2B]), MIPI_DPHY0_TX_D3N (out, see MIPI_D_CPHY_TX_DUAL[2B]), MIPI_DPHY0_TX_D3P (out, see MIPI_D_CPHY_TX_DUAL[2B]), MIPI_DPHY1_TX_CLKN (out, see MIPI_D_CPHY_TX_DUAL[2B]), MIPI_DPHY1_TX_CLKP (out, see MIPI_D_CPHY_TX_DUAL[2B]), MIPI_DPHY1_TX_D0N (out, see MIPI_D_CPHY_TX_DUAL[2B]), MIPI_DPHY1_TX_D0P (out, see MIPI_D_CPHY_TX_DUAL[2B]), MIPI_DPHY1_TX_D1N (out, see MIPI_D_CPHY_TX_DUAL[2B]), MIPI_DPHY1_TX_D1P (out, see MIPI_D_CPHY_TX_DUAL[2B]), MIPI_DPHY1_TX_D2N (out, see MIPI_D_CPHY_TX_DUAL[2B]), MIPI_DPHY1_TX_D2P (out, see MIPI_D_CPHY_TX_DUAL[2B]), MIPI_DPHY1_TX_D3N (out, see MIPI_D_CPHY_TX_DUAL[2B]), MIPI_DPHY1_TX_D3P (out, see MIPI_D_CPHY_TX_DUAL[2B])

### Nets
GND: C?#65.2 C?#66.2 C?#67.2 C?#68.2 C?#69.2 C?#70.2 C?#71.2 C?#72.2 C?#73.2
VCC_1V8_S0: C?#72.1 C?#73.1 U?#12.AJ20(MIPI_D/C_PHY0_VDD_1V8) U?#13.AJ19(MIPI_D/C_PHY1_VDD_1V8)
VDD_0V75_S0: C?#67.1 C?#68.1 C?#69.1 U?#12.AG20(MIPI_D/C_PHY0_VDD) U?#13.AG19(MIPI_D/C_PHY1_VDD)
VDDA_1V2_S0: C?#70.1 C?#71.1 U?#12.AH20(MIPI_D/C_PHY0_VDD_1V2) U?#13.AH19(MIPI_D/C_PHY1_VDD_1V2)
MIPI_DPHY0_TX_CLKN: U?#12.AP26(MIPI_DPHY0_TX_CLKN/MIPI_CPHY0_TX_TRIO1_B) ; port MIPI_DPHY0_TX_CLKN
MIPI_DPHY0_TX_CLKP: U?#12.AN26(MIPI_DPHY0_TX_CLKP/MIPI_CPHY0_TX_TRIO1_C) ; port MIPI_DPHY0_TX_CLKP
MIPI_DPHY0_TX_D0N: U?#12.AP24(MIPI_DPHY0_TX_D0N/MIPI_CPHY0_TX_TRIO0_A) ; port MIPI_DPHY0_TX_D0N
MIPI_DPHY0_TX_D0P: U?#12.AN24(MIPI_DPHY0_TX_D0P/MIPI_CPHY0_TX_TRIO0_B) ; port MIPI_DPHY0_TX_D0P
MIPI_DPHY0_TX_D1N: U?#12.AP25(MIPI_DPHY0_TX_D1N/MIPI_CPHY0_TX_TRIO0_C) ; port MIPI_DPHY0_TX_D1N
MIPI_DPHY0_TX_D1P: U?#12.AN25(MIPI_DPHY0_TX_D1P/MIPI_CPHY0_TX_TRIO1_A) ; port MIPI_DPHY0_TX_D1P
MIPI_DPHY0_TX_D2N: U?#12.AP27(MIPI_DPHY0_TX_D2N/MIPI_CPHY0_TX_TRIO2_A) ; port MIPI_DPHY0_TX_D2N
MIPI_DPHY0_TX_D2P: U?#12.AN27(MIPI_DPHY0_TX_D2P/MIPI_CPHY0_TX_TRIO2_B) ; port MIPI_DPHY0_TX_D2P
MIPI_DPHY0_TX_D3N: U?#12.AP28(MIPI_DPHY0_TX_D3N/MIPI_CPHY0_TX_TRIO2_C) ; port MIPI_DPHY0_TX_D3N
MIPI_DPHY0_TX_D3P: U?#12.AN28(MIPI_DPHY0_TX_D3P/NO_USE) ; port MIPI_DPHY0_TX_D3P
MIPI_DPHY1_TX_CLKN: U?#13.AP20(MIPI_DPHY1_TX_CLKN/MIPI_CPHY1_TX_TRIO1_B) ; port MIPI_DPHY1_TX_CLKN
MIPI_DPHY1_TX_CLKP: U?#13.AN20(MIPI_DPHY1_TX_CLKP/MIPI_CPHY1_TX_TRIO1_C) ; port MIPI_DPHY1_TX_CLKP
MIPI_DPHY1_TX_D0N: U?#13.AP18(MIPI_DPHY1_TX_D0N/MIPI_CPHY1_TX_TRIO0_A) ; port MIPI_DPHY1_TX_D0N
MIPI_DPHY1_TX_D0P: U?#13.AN18(MIPI_DPHY1_TX_D0P/MIPI_CPHY1_TX_TRIO0_B) ; port MIPI_DPHY1_TX_D0P
MIPI_DPHY1_TX_D1N: U?#13.AP19(MIPI_DPHY1_TX_D1N/MIPI_CPHY1_TX_TRIO0_C) ; port MIPI_DPHY1_TX_D1N
MIPI_DPHY1_TX_D1P: U?#13.AN19(MIPI_DPHY1_TX_D1P/MIPI_CPHY1_TX_TRIO1_A) ; port MIPI_DPHY1_TX_D1P
MIPI_DPHY1_TX_D2N: U?#13.AP21(MIPI_DPHY1_TX_D2N/MIPI_CPHY1_TX_TRIO2_A) ; port MIPI_DPHY1_TX_D2N
MIPI_DPHY1_TX_D2P: U?#13.AN21(MIPI_DPHY1_TX_D2P/MIPI_CPHY1_TX_TRIO2_B) ; port MIPI_DPHY1_TX_D2P
MIPI_DPHY1_TX_D3N: U?#13.AP22(MIPI_DPHY1_TX_D3N/MIPI_CPHY1_TX_TRIO2_C) ; port MIPI_DPHY1_TX_D3N
MIPI_DPHY1_TX_D3P: U?#13.AN22(MIPI_DPHY1_TX_D3P/NO_USE) ; port MIPI_DPHY1_TX_D3P
NetC?#65_1: C?#65.1 U?#12.AF20(MIPI_D/C_PHY0_VREG)
NetC?#66_1: C?#66.1 U?#13.AF19(MIPI_D/C_PHY1_VREG)

Not connected (* = marked no-connect by the designer): U?#12 AN29(MIPI_DPHY0_RX_D0P/MIPI_CPHY0_RX_TRIO0_B) AN30(MIPI_DPHY0_RX_D1P/MIPI_CPHY0_RX_TRIO1_A) AN32(MIPI_DPHY0_RX_CLKP/MIPI_CPHY0_RX_TRIO1_C) AN33(MIPI_DPHY0_RX_D2P/MIPI_CPHY0_RX_TRIO2_B) AN34(MIPI_DPHY0_RX_D3P/NO_USE) AP29(MIPI_DPHY0_RX_D0N/MIPI_CPHY0_RX_TRIO0_A) AP30(MIPI_DPHY0_RX_D1N/MIPI_CPHY0_RX_TRIO0_C) AP31(MIPI_DPHY0_RX_CLKN/MIPI_CPHY0_RX_TRIO1_B) AP32(MIPI_DPHY0_RX_D2N/MIPI_CPHY0_RX_TRIO2_A) AP33(MIPI_DPHY0_RX_D3N/MIPI_CPHY0_RX_TRIO2_C); U?#13 AK18(MIPI_DPHY1_RX_D0P/MIPI_CPHY1_RX_TRIO0_B) AK19(MIPI_DPHY1_RX_D1P/MIPI_CPHY1_RX_TRIO1_A) AK20(MIPI_DPHY1_RX_CLKP/MIPI_CPHY1_RX_TRIO1_C) AK21(MIPI_DPHY1_RX_D2P/MIPI_CPHY1_RX_TRIO2_B) AK22(MIPI_DPHY1_RX_D3P/NO_USE) AL18(MIPI_DPHY1_RX_D0N/MIPI_CPHY1_RX_TRIO0_A) AL19(MIPI_DPHY1_RX_D1N/MIPI_CPHY1_RX_TRIO0_C) AL20(MIPI_DPHY1_RX_CLKN/MIPI_CPHY1_RX_TRIO1_B) AL21(MIPI_DPHY1_RX_D2N/MIPI_CPHY1_RX_TRIO2_A) AL22(MIPI_DPHY1_RX_D3N/MIPI_CPHY1_RX_TRIO2_C); U?#14 AA25(MIPI_CSI1_AVCC0V75) AA26(MIPI_CSI1_AVCC1V8) AB25(MIPI_CSI0_AVCC0V75) AB26(MIPI_CSI0_AVCC1V8) AG31(MIPI_CSI1_D0P) AG32(MIPI_CSI1_D0N) AG33(MIPI_CSI0_D0P) AG34(MIPI_CSI0_D0N) AH31(MIPI_CSI1_D1P) AH32(MIPI_CSI1_D1N) AH33(MIPI_CSI0_D1P) AH34(MIPI_CSI0_D1N) AJ31(MIPI_CSI1_CLK0P) AJ32(MIPI_CSI1_CLK0N) AJ33(MIPI_CSI0_CLK0P) AJ34(MIPI_CSI0_CLK0N) AK31(MIPI_CSI1_D2P) AK32(MIPI_CSI1_D2N) AK33(MIPI_CSI0_D2P) AK34(MIPI_CSI0_D2N) AL31(MIPI_CSI1_D3P) AL32(MIPI_CSI1_D3N) AL33(MIPI_CSI0_D3P) AL34(MIPI_CSI0_D3N) AM31(MIPI_CSI1_CLK1P) AM32(MIPI_CSI1_CLK1N) AM33(MIPI_CSI0_CLK1P) AM34(MIPI_CSI0_CLK1N)

### Notes on the sheet
- RK3588_Q/R(MIPI_D/C_PHY0/1)
- MIPI CPHY Single:
  50 Ohm +-10%
- MIPI DPHY Differential Pair:
  100 Ohm +-10%
- D-PHY 4.5Gbps & C-PHY 2.5Gsps 0.85V
  D-PHY 2.5Gbps & C-PHY 1.5Gsps 0.75V
- If not used:
  Signal:leave floating
  Power: Floating
- Note:
- RK3588_P(MIPI_DPHY_CSI_RX_PHY)
- MIPI_CSI_RX Configuration
- MIPI CSI Differential Pair:
  100 Ohm +-10%
- Option1
- Sensor1
- x4Lane
- MIPI_CSI_RX_D0-3
- MIPI_CSI_RX_CLK0
- Option2
- +
- x2Lane
- MIPI_CSI_RX_D0-1
- Sensor2
- MIPI_CSI_RX_D2-3
- MIPI_CSI_RX_CLK1
- When in single clock lane mode, CLK0P/0N is the clock lane
  from Data lane0 to Data lane3,but clock lane1 is invalid; In
  dual clock lanes mode,CLK0P/0N is the clock lane of Data lane0
  and Data lane1,while CLK1P/1N is the clock lane of Data lane2
  and Data lane3.
- The Caps to the left of green line should be placed
  under the U1000 package.Other caps should be placed
  close to the U1000 package.
- 420x594
- Формат А2
- (in symbol SOC_RK3588, part P) MIPI DPHY CSI_RX Port0; MIPI V1.2/2.5Gbps; MIPI DPHY CSI_RX Port1
- (in symbol SOC_RK3588, part Q) MIPI D/C-PHY DSI_TX Port0; D-PHY:V2.0  4.5Gbps/Lane / C-PHY:V1.1  5.7Gbps/Trio; MIPI D/C-PHY CSI_RX Port0; MIPI D/C-PHY POWER
- (in symbol SOC_RK3588, part R) MIPI D/C-PHY DSI_TX Port1; D-PHY:V2.0  4.5Gbps/Lane / C-PHY:V1.1  5.7Gbps/Trio; MIPI D/C-PHY CSI_RX Port1; MIPI D/C-PHY POWER

### Library data of the parts
C?#65 = CAP NP_Dup1: cap,2.20nF,+/-10%,6.3V,X7R,C0201; Part Reference: C1600; Manufacturer PN: C0603X7R0J222K030BA; Manufacturer: TDK; Tolerance: 10%; Priority: A; PCB Footprint: C0201; Value: 2.2nF; Created by: JJJ; Part Type: C0201; RK PN: C0603X7R0J222K030BA
C?#66 = CAP NP_Dup1: cap,2.20nF,+/-10%,6.3V,X7R,C0201; Part Reference: C1608; Manufacturer PN: C0603X7R0J222K030BA; Manufacturer: TDK; Tolerance: 10%; Priority: A; PCB Footprint: C0201; Value: 2.2nF; Created by: JJJ; Part Type: C0201; RK PN: C0603X7R0J222K030BA
C?#67 = CAP NP_Dup1: cap,100.00nF,+/-10%,6.3V,X5R,C0201; Part Reference: C1602; Manufacturer: TDK; RK PN: C0603X5R0J104K030BC; Priority: A; Tolerance: 10%; PCB Footprint: C0201; Value: 100nF; Part Type: C0201; Manufacturer PN: C0603X5R0J104K030BC; Created by: JJJ
C?#68 = CAP NP_Dup1: cap,1.00uF,+/-20%,6.3V,X5R,C0201; Part Reference: C1601; Manufacturer: TDK; RK PN: C0603X5R0J105M030BC; Priority: A; Tolerance: 20%; PCB Footprint: C0201; Value: 1uF; Part Type: C0201; Manufacturer PN: C0603X5R0J105M030BC; Created by: JJJ
C?#69 = CAP NP_Dup1: cap,1.00uF,+/-20%,6.3V,X5R,C0201; Part Reference: C1609; Manufacturer: TDK; RK PN: C0603X5R0J105M030BC; Priority: A; Tolerance: 20%; PCB Footprint: C0201; Value: 1uF; Part Type: C0201; Manufacturer PN: C0603X5R0J105M030BC; Created by: JJJ
C?#70 = CAP NP_Dup1: cap,1.00uF,+/-20%,6.3V,X5R,C0201; Part Reference: C1603; Manufacturer PN: C0603X5R0J105M030BC; Manufacturer: TDK; Tolerance: 20%; Priority: A; PCB Footprint: C0201; Value: 1uF; Created by: JJJ; Part Type: C0201; RK PN: C0603X5R0J105M030BC
C?#71 = CAP NP_Dup1: cap,100.00nF,+/-10%,6.3V,X5R,C0201; Part Reference: C1611; Manufacturer: TDK; RK PN: C0603X5R0J104K030BC; Priority: A; Tolerance: 10%; PCB Footprint: C0201; Value: 100nF; Part Type: C0201; Manufacturer PN: C0603X5R0J104K030BC; Created by: JJJ
C?#72 = CAP NP_Dup1: cap,1.00uF,+/-20%,6.3V,X5R,C0201; Part Reference: C1605; Manufacturer PN: C0603X5R0J105M030BC; Manufacturer: TDK; Tolerance: 20%; Priority: A; PCB Footprint: C0201; Value: 1uF; Created by: JJJ; Part Type: C0201; RK PN: C0603X5R0J105M030BC
C?#73 = CAP NP_Dup1: cap,1.00uF,+/-20%,6.3V,X5R,C0201; Part Reference: C1613; Manufacturer: TDK; RK PN: C0603X5R0J105M030BC; Priority: A; Tolerance: 20%; PCB Footprint: C0201; Value: 1uF; Part Type: C0201; Manufacturer PN: C0603X5R0J105M030BC; Created by: JJJ
U?#12-U?#14 = SOC_RK3588: as U?#9-U?#11 on sheet RK3588_BOOTLOADER_MAYBE_SDIO; Value: RK3588; PCB Footprint: BGA1088_23R00X23R00X2R00; Created by: YWQ; Manufacturer PN: RK3588; Part Type: SOC; RK PN: RK3588

## Sheet RK3588_PCIE20_30.SchDoc
size 594 x 420 mm; SheetNumber: 9; SheetTotal: 23
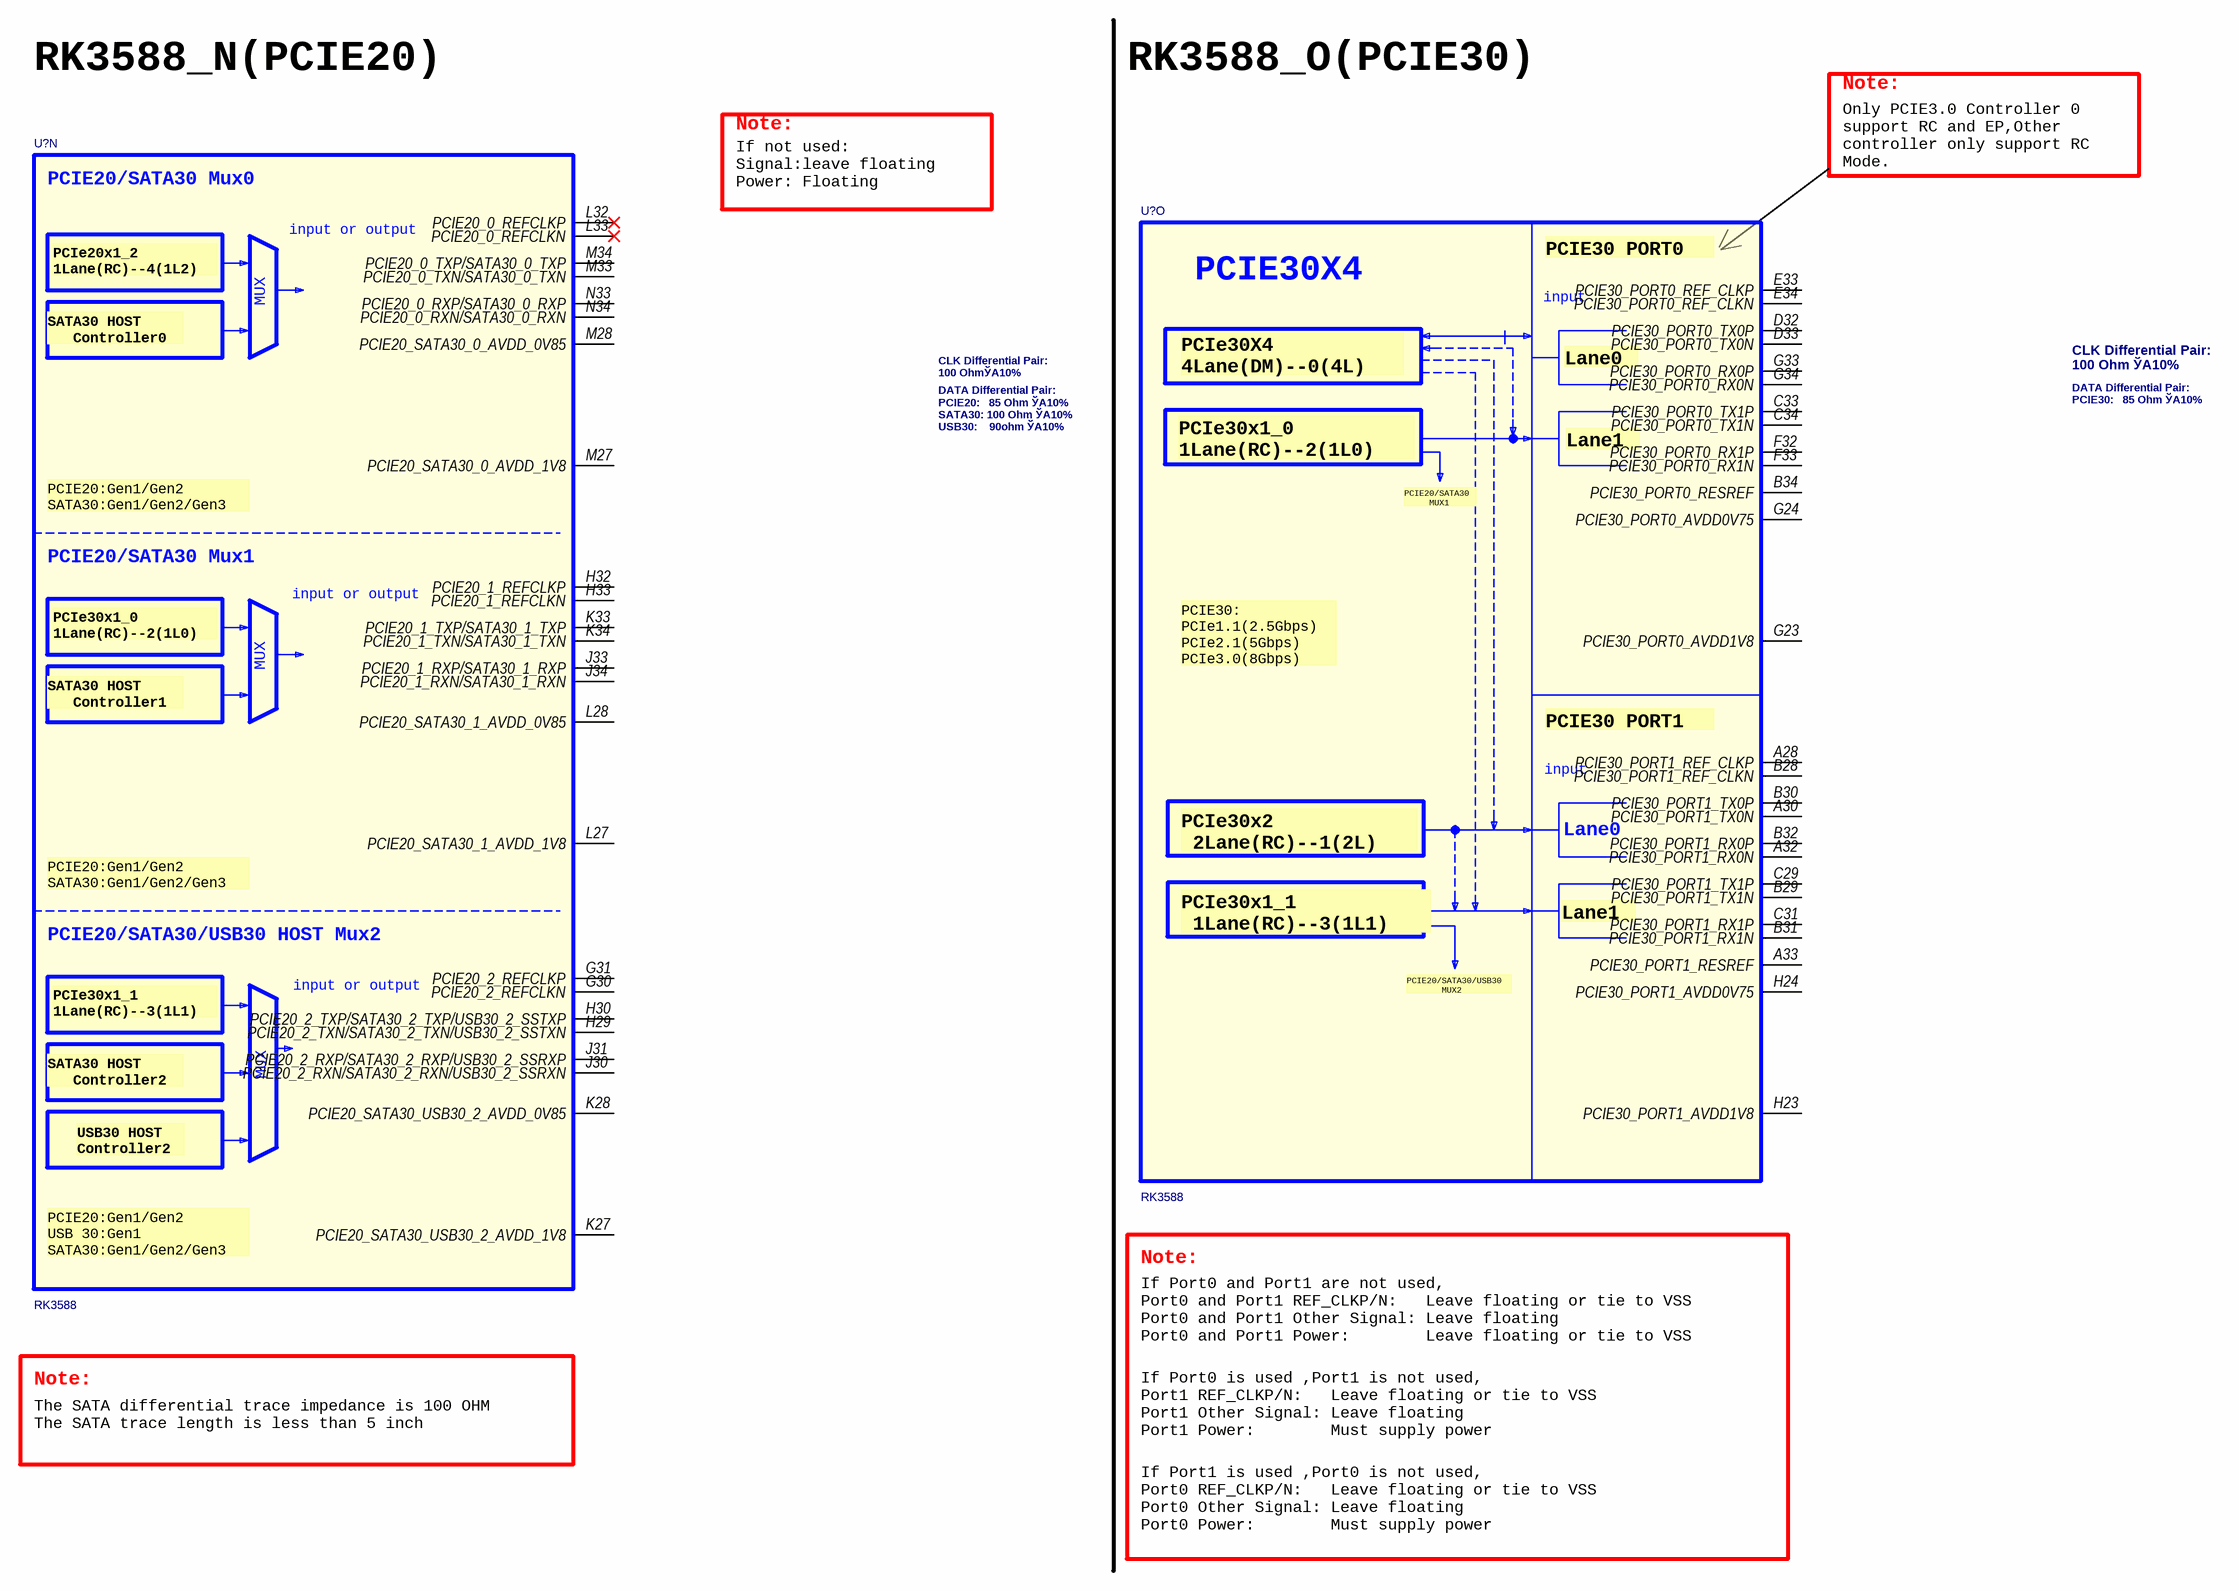
[diagram p10: RK3588_PCIE20_30.SchDoc]

### Parts
(Parts that share a designator on the sheet are numbered #1, #2 ... from top to bottom, then left to right.)
U?#15  RK3588  [BGA1088_23R00X23R00X2R00]  (part N of 26)
U?#16  RK3588  [BGA1088_23R00X23R00X2R00]  (part O of 26)

### Nets

Not connected (* = marked no-connect by the designer): U?#15 G30(PCIE20_2_REFCLKN) G31(PCIE20_2_REFCLKP) H29(PCIE20_2_TXN/SATA30_2_TXN/USB30_2_SSTXN) H30(PCIE20_2_TXP/SATA30_2_TXP/USB30_2_SSTXP) H32(PCIE20_1_REFCLKP) H33(PCIE20_1_REFCLKN) J30(PCIE20_2_RXN/SATA30_2_RXN/USB30_2_SSRXN) J31(PCIE20_2_RXP/SATA30_2_RXP/USB30_2_SSRXP) J33(PCIE20_1_RXP/SATA30_1_RXP) J34(PCIE20_1_RXN/SATA30_1_RXN) K27(PCIE20_SATA30_USB30_2_AVDD_1V8) K28(PCIE20_SATA30_USB30_2_AVDD_0V85) K33(PCIE20_1_TXP/SATA30_1_TXP) K34(PCIE20_1_TXN/SATA30_1_TXN) L27(PCIE20_SATA30_1_AVDD_1V8) L28(PCIE20_SATA30_1_AVDD_0V85) L32(PCIE20_0_REFCLKP)* L33(PCIE20_0_REFCLKN)* M27(PCIE20_SATA30_0_AVDD_1V8) M28(PCIE20_SATA30_0_AVDD_0V85) M33(PCIE20_0_TXN/SATA30_0_TXN) M34(PCIE20_0_TXP/SATA30_0_TXP) N33(PCIE20_0_RXP/SATA30_0_RXP) N34(PCIE20_0_RXN/SATA30_0_RXN); U?#16 A28(PCIE30_PORT1_REF_CLKP) A30(PCIE30_PORT1_TX0N) A32(PCIE30_PORT1_RX0N) A33(PCIE30_PORT1_RESREF) B28(PCIE30_PORT1_REF_CLKN) B29(PCIE30_PORT1_TX1N) B30(PCIE30_PORT1_TX0P) B31(PCIE30_PORT1_RX1N) B32(PCIE30_PORT1_RX0P) B34(PCIE30_PORT0_RESREF) C29(PCIE30_PORT1_TX1P) C31(PCIE30_PORT1_RX1P) C33(PCIE30_PORT0_TX1P) C34(PCIE30_PORT0_TX1N) D32(PCIE30_PORT0_TX0P) D33(PCIE30_PORT0_TX0N) E33(PCIE30_PORT0_REF_CLKP) E34(PCIE30_PORT0_REF_CLKN) F32(PCIE30_PORT0_RX1P) F33(PCIE30_PORT0_RX1N) G23(PCIE30_PORT0_AVDD1V8) G24(PCIE30_PORT0_AVDD0V75) G33(PCIE30_PORT0_RX0P) G34(PCIE30_PORT0_RX0N) H23(PCIE30_PORT1_AVDD1V8) H24(PCIE30_PORT1_AVDD0V75)

### Notes on the sheet
- RK3588_N(PCIE20)
- RK3588_O(PCIE30)
- Note:
- If not used:
  Signal:leave floating
  Power: Floating
- Only PCIE3.0 Controller 0
  support RC and EP,Other
  controller only support RC
  Mode.
- CLK Differential Pair:
  100 OhmЎА10%
- CLK Differential Pair:
  100 Ohm ЎА10%
- DATA Differential Pair:
  PCIE30:   85 Ohm ЎА10%
- DATA Differential Pair:
  PCIE20:   85 Ohm ЎА10%
  SATA30: 100 Ohm ЎА10%
  USB30:    90ohm ЎА10%
- If Port0 and Port1 are not used,
  Port0 and Port1 REF_CLKP/N:   Leave floating or tie to VSS
  Port0 and Port1 Other Signal: Leave floating
  Port0 and Port1 Power:        Leave floating or tie to VSS
- The SATA differential trace impedance is 100 OHM
  The SATA trace length is less than 5 inch
- If Port0 is used ,Port1 is not used,
  Port1 REF_CLKP/N:   Leave floating or tie to VSS
  Port1 Other Signal: Leave floating
  Port1 Power:        Must supply power
- If Port1 is used ,Port0 is not used,
  Port0 REF_CLKP/N:   Leave floating or tie to VSS
  Port0 Other Signal: Leave floating
  Port0 Power:        Must supply power
- 420x594
- Формат А2
- (in symbol SOC_RK3588, part N) PCIE20/SATA30 Mux0; input or output; PCIe20x1_2 / 1Lane(RC)--4(1L2); MUX; SATA30 HOST / Controller0; PCIE20:Gen1/Gen2 / SATA30:Gen1/Gen2/Gen3; PCIE20/SATA30 Mux1; PCIe30x1_0 / 1Lane(RC)--2(1L0); SATA30 HOST / Controller1; PCIE20/SATA30/USB30 HOST Mux2; PCIe30x1_1 / 1Lane(RC)--3(1L1); SATA30 HOST / Controller2; USB30 HOST / Controller2; PCIE20:Gen1/Gen2 / USB 30:Gen1 / SATA30:Gen1/Gen2/Gen3
- (in symbol SOC_RK3588, part O) PCIE30 PORT0 /; PCIE30X4; input; Lane0 /; PCIe30X4 / 4Lane(DM)--0(4L); Lane1 /; PCIe30x1_0 / 1Lane(RC)--2(1L0); PCIE20/SATA30 / MUX1; PCIE30: / PCIe1.1(2.5Gbps) / PCIe2.1(5Gbps) / PCIe3.0(8Gbps) /; PCIE30 PORT1 /; Lane0; PCIe30x2 / 2Lane(RC)--1(2L); PCIe30x1_1 / 1Lane(RC)--3(1L1); PCIE20/SATA30/USB30 / MUX2

### Library data of the parts
U?#15 U?#16 = SOC_RK3588: as U?#9-U?#11 on sheet RK3588_BOOTLOADER_MAYBE_SDIO; Value: RK3588; Created by: YWQ; Manufacturer PN: RK3588; Part Type: SOC; RK PN: RK3588; PCB Footprint: BGA1088_23R00X23R00X2R00

## Sheet RK3588_HDMI.SchDoc
size 420 x 297 mm; SheetNumber: 10; SheetTotal: 23
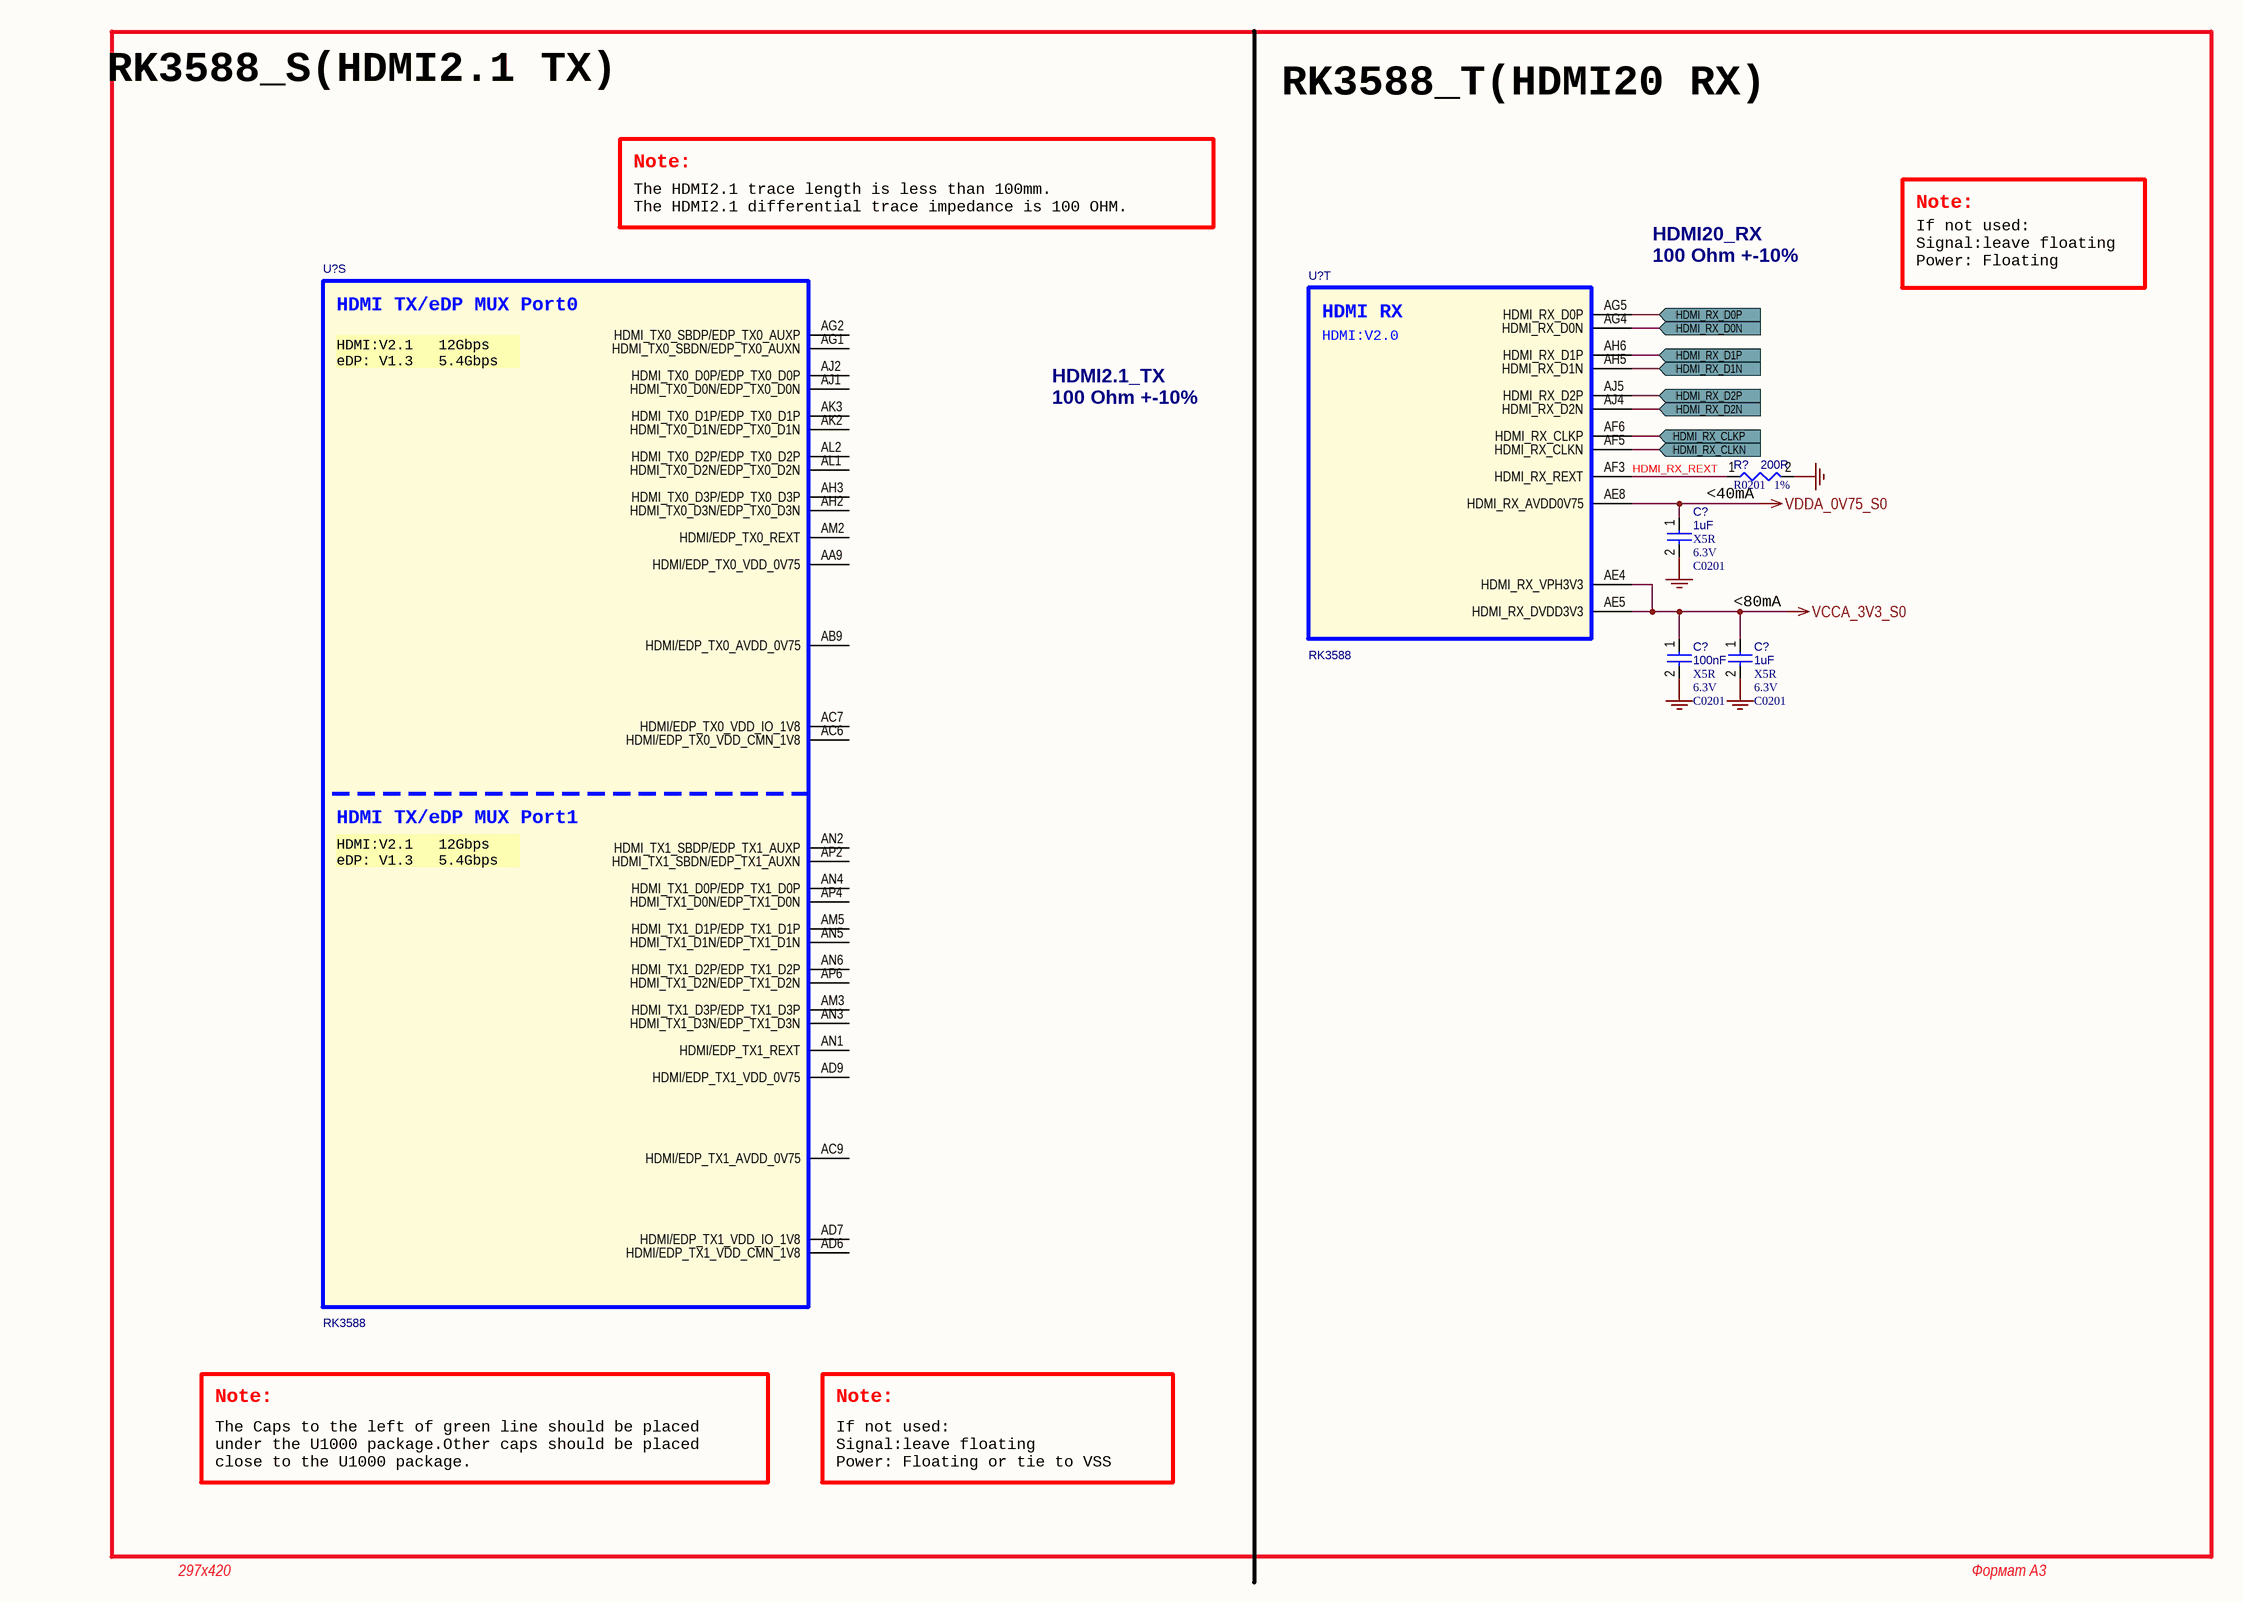
[diagram p11: RK3588_HDMI.SchDoc]

### Parts
(Parts that share a designator on the sheet are numbered #1, #2 ... from top to bottom, then left to right.)
C?#74  1uF  Dielectric: X5R  Voltage: 6.3V  [C0201]
C?#75  100nF  Dielectric: X5R  Voltage: 6.3V  [C0201]
C?#76  1uF  Dielectric: X5R  Voltage: 6.3V  [C0201]
R?#28  200R  Tolerance: 1%  PCB Footprint: R0201  [R0402]
U?#17  RK3588  [BGA1088_23R00X23R00X2R00]  (part S of 26)
U?#18  RK3588  [BGA1088_23R00X23R00X2R00]  (part T of 26)

### Ports
HDMI_RX_CLKN (in, see HDMI2_0_RX[3B]), HDMI_RX_CLKP (in, see HDMI2_0_RX[3B]), HDMI_RX_D0N (in, see HDMI2_0_RX[3B]), HDMI_RX_D0P (in, see HDMI2_0_RX[3B]), HDMI_RX_D1N (in, see HDMI2_0_RX[3B]), HDMI_RX_D1P (in, see HDMI2_0_RX[3B]), HDMI_RX_D2N (in, see HDMI2_0_RX[3B]), HDMI_RX_D2P (in, see HDMI2_0_RX[3B])

### Nets
GND: C?#74.2 C?#75.2 C?#76.2 R?#28.2
VCCA_3V3_S0: C?#75.1 C?#76.1 U?#18.AE4(HDMI_RX_VPH3V3) U?#18.AE5(HDMI_RX_DVDD3V3)
VDDA_0V75_S0: C?#74.1 U?#18.AE8(HDMI_RX_AVDD0V75)
HDMI_RX_REXT: R?#28.1 U?#18.AF3(HDMI_RX_REXT)
NetR?#138_2: U?#18.AF5(HDMI_RX_CLKN) ; port HDMI_RX_CLKN
NetR?#139_2: U?#18.AF6(HDMI_RX_CLKP) ; port HDMI_RX_CLKP
NetR?#140_2: U?#18.AG4(HDMI_RX_D0N) ; port HDMI_RX_D0N
NetR?#141_2: U?#18.AG5(HDMI_RX_D0P) ; port HDMI_RX_D0P
NetR?#142_2: U?#18.AH5(HDMI_RX_D1N) ; port HDMI_RX_D1N
NetR?#143_2: U?#18.AH6(HDMI_RX_D1P) ; port HDMI_RX_D1P
NetR?#144_2: U?#18.AJ4(HDMI_RX_D2N) ; port HDMI_RX_D2N
NetR?#145_2: U?#18.AJ5(HDMI_RX_D2P) ; port HDMI_RX_D2P

Not connected (* = marked no-connect by the designer): U?#17 AA9(HDMI/EDP_TX0_VDD_0V75) AB9(HDMI/EDP_TX0_AVDD_0V75) AC6(HDMI/EDP_TX0_VDD_CMN_1V8) AC7(HDMI/EDP_TX0_VDD_IO_1V8) AC9(HDMI/EDP_TX1_AVDD_0V75) AD6(HDMI/EDP_TX1_VDD_CMN_1V8) AD7(HDMI/EDP_TX1_VDD_IO_1V8) AD9(HDMI/EDP_TX1_VDD_0V75) AG1(HDMI_TX0_SBDN/EDP_TX0_AUXN) AG2(HDMI_TX0_SBDP/EDP_TX0_AUXP) AH2(HDMI_TX0_D3N/EDP_TX0_D3N) AH3(HDMI_TX0_D3P/EDP_TX0_D3P) AJ1(HDMI_TX0_D0N/EDP_TX0_D0N) AJ2(HDMI_TX0_D0P/EDP_TX0_D0P) AK2(HDMI_TX0_D1N/EDP_TX0_D1N) AK3(HDMI_TX0_D1P/EDP_TX0_D1P) AL1(HDMI_TX0_D2N/EDP_TX0_D2N) AL2(HDMI_TX0_D2P/EDP_TX0_D2P) AM2(HDMI/EDP_TX0_REXT) AM3(HDMI_TX1_D3P/EDP_TX1_D3P) AM5(HDMI_TX1_D1P/EDP_TX1_D1P) AN1(HDMI/EDP_TX1_REXT) AN2(HDMI_TX1_SBDP/EDP_TX1_AUXP) AN3(HDMI_TX1_D3N/EDP_TX1_D3N) AN4(HDMI_TX1_D0P/EDP_TX1_D0P) AN5(HDMI_TX1_D1N/EDP_TX1_D1N) AN6(HDMI_TX1_D2P/EDP_TX1_D2P) AP2(HDMI_TX1_SBDN/EDP_TX1_AUXN) AP4(HDMI_TX1_D0N/EDP_TX1_D0N) AP6(HDMI_TX1_D2N/EDP_TX1_D2N)

### Notes on the sheet
- RK3588_S(HDMI2.1 TX)
- RK3588_T(HDMI20 RX)
- Note:
- The HDMI2.1 trace length is less than 100mm.
  The HDMI2.1 differential trace impedance is 100 OHM.
- HDMI20_RX
  100 Ohm +-10%
- If not used:
  Signal:leave floating
  Power: Floating
- HDMI2.1_TX
  100 Ohm +-10%
- (near R?#28) <40mA
- (near C?#76) <80mA
- The Caps to the left of green line should be placed
  under the U1000 package.Other caps should be placed
  close to the U1000 package.
- If not used:
  Signal:leave floating
  Power: Floating or tie to VSS
- 297x420
- Формат А3
- (in symbol SOC_RK3588, part S) HDMI TX/eDP MUX Port0; HDMI:V2.1   12Gbps / eDP: V1.3   5.4Gbps; HDMI TX/eDP MUX Port1
- (in symbol SOC_RK3588, part T) HDMI RX; HDMI:V2.0

### Library data of the parts
C?#74 = CAP NP_Dup1: cap,1.00uF,+/-20%,6.3V,X5R,C0201; Part Reference: C1738; Manufacturer: TDK; RK PN: C0603X5R0J105M030BC; Priority: A; Tolerance: 20%; PCB Footprint: C0201; Value: 1uF; Part Type: C0201; Manufacturer PN: C0603X5R0J105M030BC; Created by: JJJ
C?#75 = CAP NP_Dup1: cap,100.00nF,+/-10%,6.3V,X5R,C0201; Part Reference: C1740; Manufacturer PN: C0603X5R0J104K030BC; Manufacturer: TDK; Tolerance: 10%; Priority: A; PCB Footprint: C0201; Value: 100nF; Created by: JJJ; Part Type: C0201; RK PN: C0603X5R0J104K030BC
C?#76 = CAP NP_Dup1: cap,1.00uF,+/-20%,6.3V,X5R,C0201; Part Reference: C1741; Manufacturer PN: C0603X5R0J105M030BC; Manufacturer: TDK; Tolerance: 20%; Priority: A; PCB Footprint: C0201; Value: 1uF; Created by: JJJ; Part Type: C0201; RK PN: C0603X5R0J105M030BC
R?#28 = RESISTOR_Dup2: НЁУГєсД¤µзЧи,200R,+/-1%,R0201,1/20W.; Part Reference: R1730; Manufacturer PN: RC0201FR-07200RL; Manufacturer: YAGEO; Wattage: 1/20W; Priority: A; Value: 200R; Created by: YTL; Part Type: НЁУГєсД¤µзЧи; RK PN: RC0201FR-07200RL
U?#17 U?#18 = SOC_RK3588: as U?#9-U?#11 on sheet RK3588_BOOTLOADER_MAYBE_SDIO; Value: RK3588; PCB Footprint: BGA1088_23R00X23R00X2R00; Created by: YWQ; Manufacturer PN: RK3588; Part Type: SOC; RK PN: RK3588

## Sheet RK3588_GPIO_MAYBE_IMPORTANT_PINS.SchDoc
size 594 x 420 mm; SheetNumber: 11; SheetTotal: 23
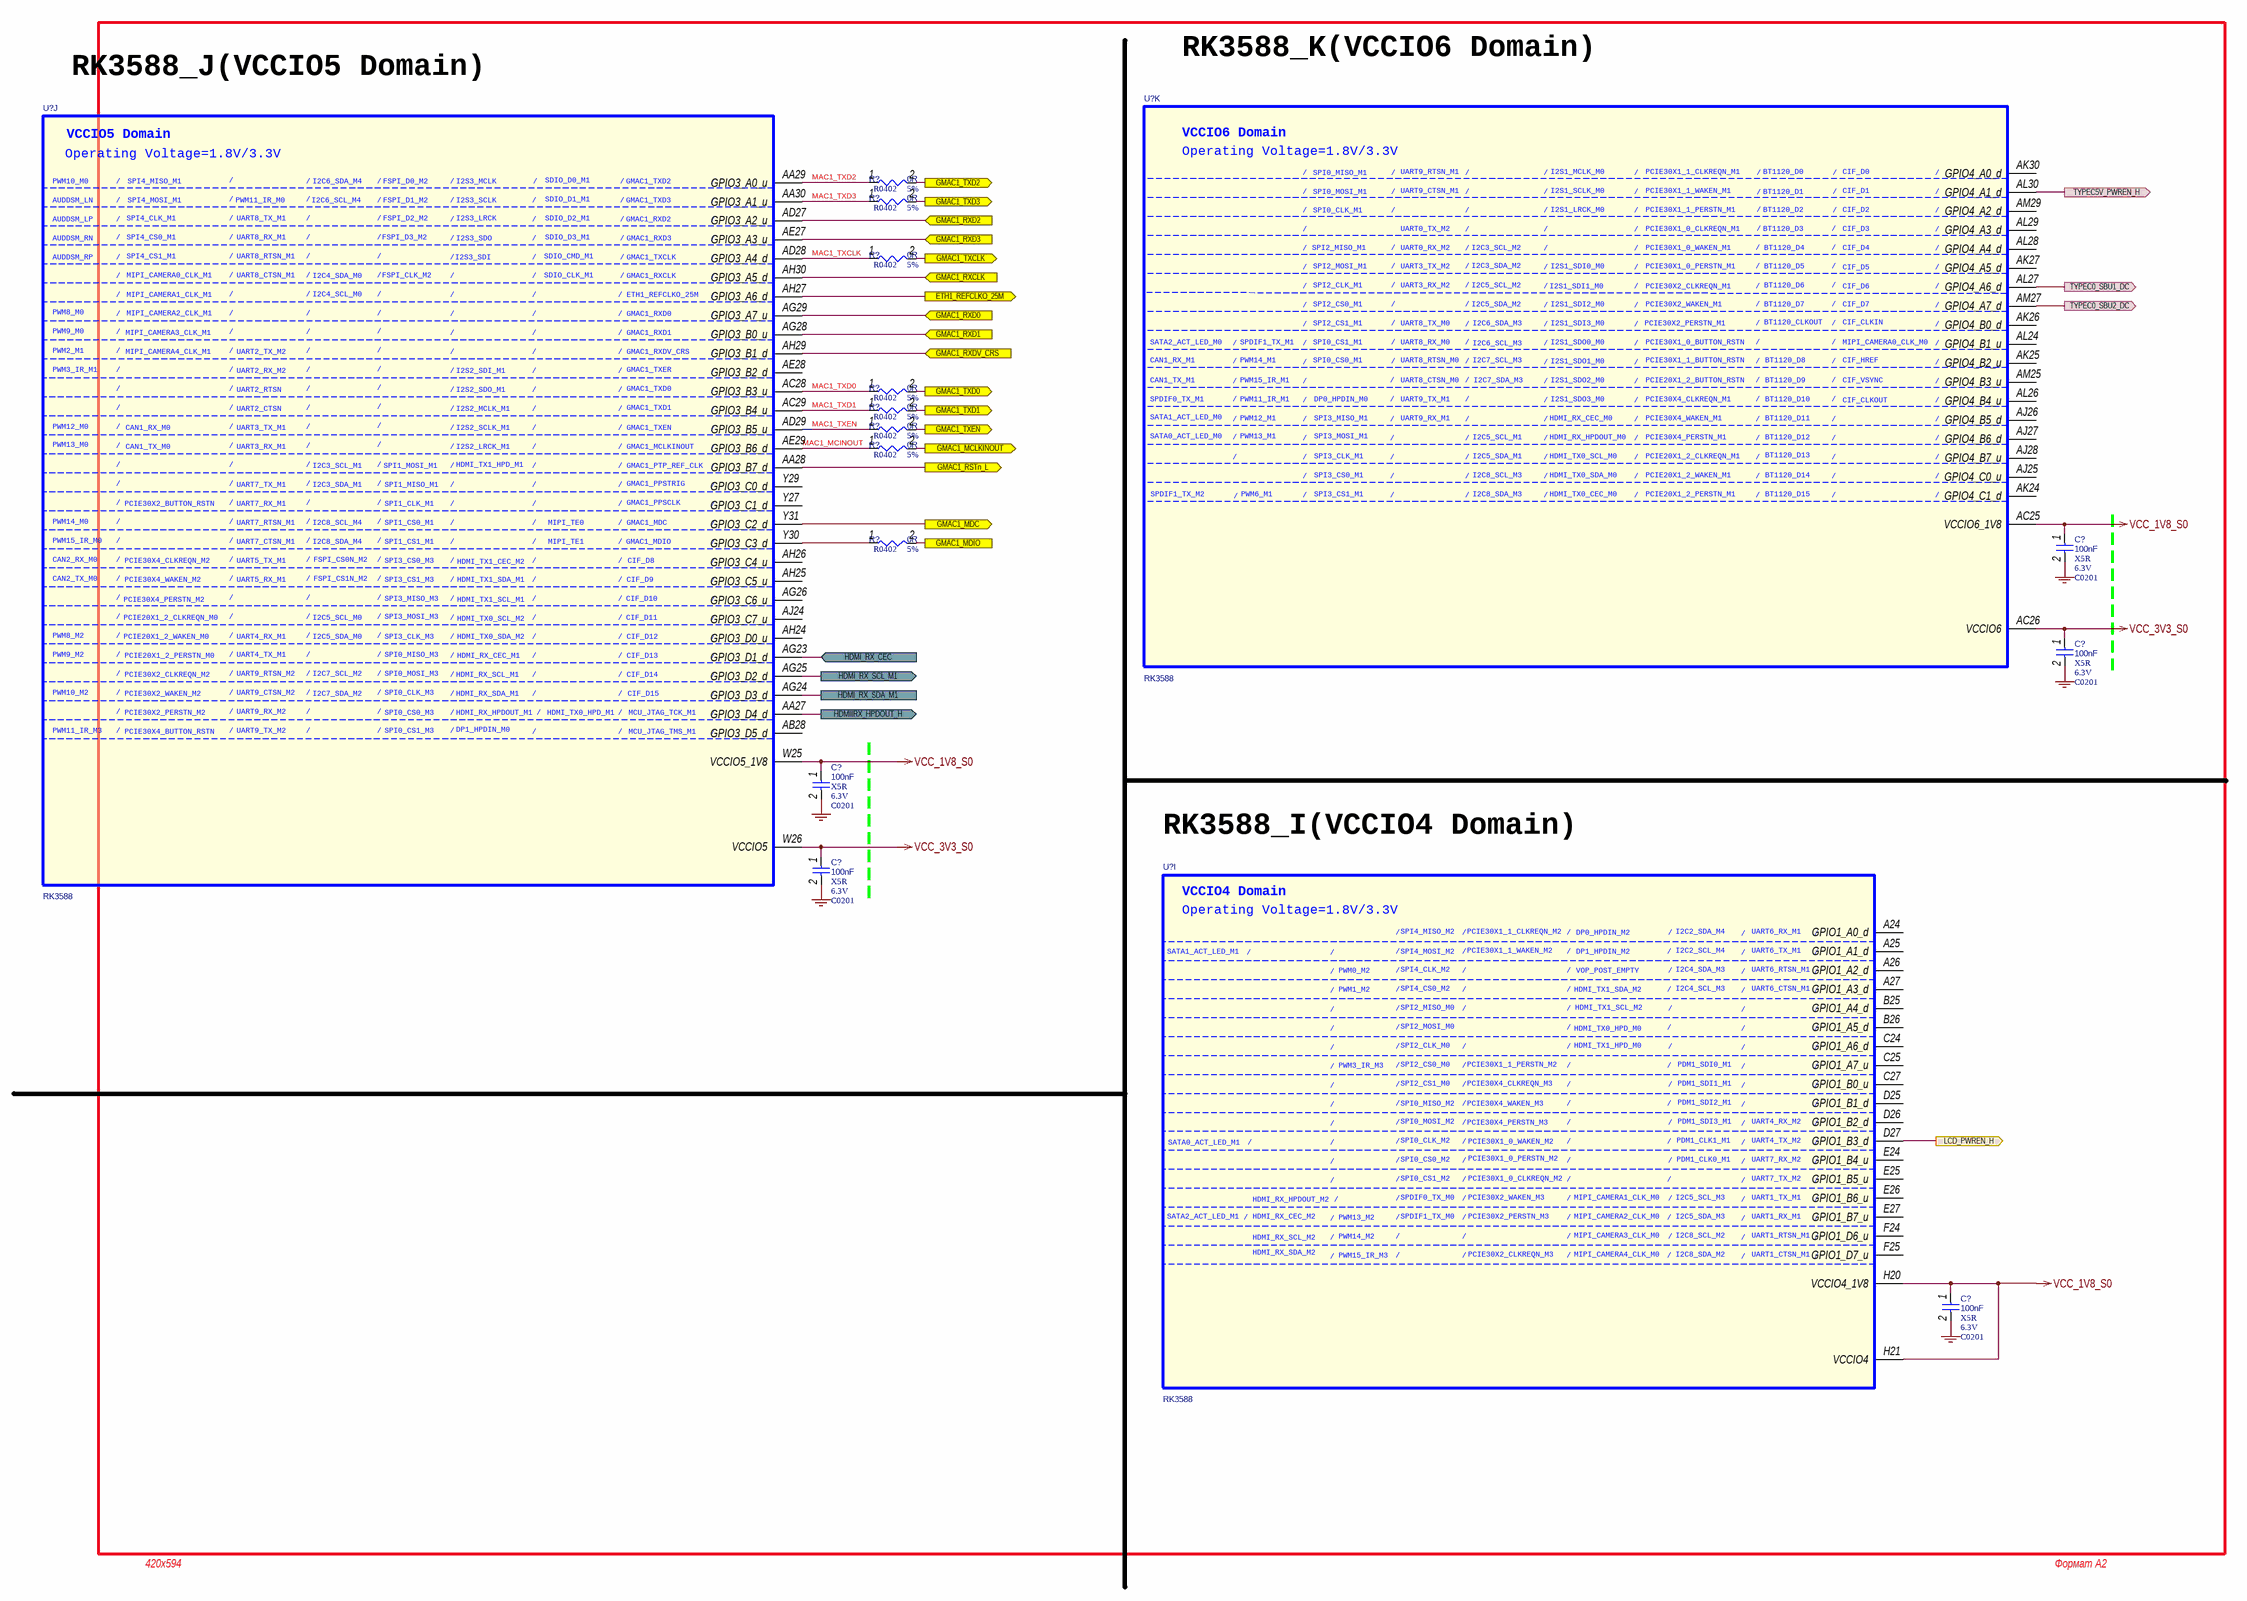
[diagram p12: RK3588_GPIO_MAYBE_IMPORTANT_PINS.SchDoc]

### Parts
(Parts that share a designator on the sheet are numbered #1, #2 ... from top to bottom, then left to right.)
C?#77  100nF  Dielectric: X5R  Voltage: 6.3V  [C0201]
C?#78  100nF  Dielectric: X5R  Voltage: 6.3V  [C0201]
C?#79  100nF  Dielectric: X5R  Voltage: 6.3V  [C0201]
C?#80  100nF  Dielectric: X5R  Voltage: 6.3V  [C0201]
C?#81  100nF  Dielectric: X5R  Voltage: 6.3V  [C0201]
R?#29  0R  Tolerance: 5%  [R0402]
R?#30  0R  Tolerance: 5%  [R0402]
R?#31  0R  Tolerance: 5%  [R0402]
R?#32  0R  Tolerance: 5%  [R0402]
R?#33  0R  Tolerance: 5%  [R0402]
R?#34  0R  Tolerance: 5%  [R0402]
R?#35  0R  Tolerance: 5%  [R0402]
R?#36  0R  Tolerance: 5%  [R0402]
U?#19  RK3588  [BGA1088_23R00X23R00X2R00]  (part K of 26)
U?#20  RK3588  [BGA1088_23R00X23R00X2R00]  (part J of 26)
U?#21  RK3588  [BGA1088_23R00X23R00X2R00]  (part I of 26)

### Ports
ETH1_REFCLKO_25M (out, see ETHERNET_PHY_RGMII[1B]), GMAC1_MCLKINOUT (out, see ETHERNET_PHY_RGMII[1B]), GMAC1_MDC (out, see ETHERNET_PHY_RGMII[1B]), GMAC1_MDIO (see ETHERNET_PHY_RGMII[1B]), GMAC1_RSTn_L (out, see ETHERNET_PHY_RGMII[1B]), GMAC1_RXCLK (in, see ETHERNET_PHY_RGMII[1B]), GMAC1_RXD0 (in, see ETHERNET_PHY_RGMII[1A]), GMAC1_RXD1 (in, see ETHERNET_PHY_RGMII[1B]), GMAC1_RXD2 (in, see ETHERNET_PHY_RGMII[1B]), GMAC1_RXD3 (in, see ETHERNET_PHY_RGMII[1B]), GMAC1_RXDV_CRS (in, see ETHERNET_PHY_RGMII[1B]), GMAC1_TXCLK (out, see ETHERNET_PHY_RGMII[1A]), GMAC1_TXD0 (out, see ETHERNET_PHY_RGMII[1A]), GMAC1_TXD1 (out, see ETHERNET_PHY_RGMII[1A]), GMAC1_TXD2 (out, see ETHERNET_PHY_RGMII[1A]), GMAC1_TXD3 (out, see ETHERNET_PHY_RGMII[1A]), GMAC1_TXEN (out, see ETHERNET_PHY_RGMII[1A]), HDMI_RX_CEC (in, see HDMI2_0_RX[3C]), HDMI_RX_SCL_M1 (out, see HDMI2_0_RX[1C]), HDMI_RX_SDA_M1 (see HDMI2_0_RX[1C]), HDMIIRX_HPDOUT_H (out, see HDMI2_0_RX[2C]), LCD_PWREN_H (out, see MIPI_D_CPHY_TX_DUAL[2B]), TYPEC0_SBU1_DC (out, see PORT_TYPE_C[2A]), TYPEC0_SBU2_DC (out, see PORT_TYPE_C[2B]), TYPEC5V_PWREN_H (out, see PORT_TYPE_C[3D])

### Nets
GND: C?#77.2 C?#78.2 C?#79.2 C?#80.2 C?#81.2
VCC_1V8_S0: C?#77.1 C?#79.1 C?#81.1 U?#19.AC25(VCCIO6_1V8) U?#20.W25(VCCIO5_1V8) U?#21.H20(VCCIO4_1V8) U?#21.H21(VCCIO4)
VCC_3V3_S0: C?#78.1 C?#80.1 U?#19.AC26(VCCIO6) U?#20.W26(VCCIO5)
ETH1_REFCLKO_25M: U?#20.AH27(GPIO3_A6_d) ; port ETH1_REFCLKO_25M
GMAC1_MCLKINOUT: R?#35.2 ; port GMAC1_MCLKINOUT
GMAC1_MDC: U?#20.Y31(GPIO3_C2_d) ; port GMAC1_MDC
GMAC1_MDIO: R?#36.2 ; port GMAC1_MDIO
GMAC1_RSTn_L: U?#20.AA28(GPIO3_B7_d) ; port GMAC1_RSTn_L
GMAC1_RXCLK: U?#20.AH30(GPIO3_A5_d) ; port GMAC1_RXCLK
GMAC1_RXD0: U?#20.AG29(GPIO3_A7_u) ; port GMAC1_RXD0
GMAC1_RXD1: U?#20.AG28(GPIO3_B0_u) ; port GMAC1_RXD1
GMAC1_RXD2: U?#20.AD27(GPIO3_A2_u) ; port GMAC1_RXD2
GMAC1_RXD3: U?#20.AE27(GPIO3_A3_u) ; port GMAC1_RXD3
GMAC1_RXDV_CRS: U?#20.AH29(GPIO3_B1_d) ; port GMAC1_RXDV_CRS
GMAC1_TXCLK: R?#31.2 ; port GMAC1_TXCLK
GMAC1_TXD0: R?#32.2 ; port GMAC1_TXD0
GMAC1_TXD1: R?#33.2 ; port GMAC1_TXD1
GMAC1_TXD2: R?#29.2 ; port GMAC1_TXD2
GMAC1_TXD3: R?#30.2 ; port GMAC1_TXD3
GMAC1_TXEN: R?#34.2 ; port GMAC1_TXEN
HDMI_RX_CEC: U?#20.AG23(GPIO3_D1_d) ; port HDMI_RX_CEC
HDMI_RX_SCL_M1: U?#20.AG25(GPIO3_D2_d) ; port HDMI_RX_SCL_M1
HDMI_RX_SDA_M1: U?#20.AG24(GPIO3_D3_d) ; port HDMI_RX_SDA_M1
HDMIIRX_HPDOUT_H: U?#20.AA27(GPIO3_D4_d) ; port HDMIIRX_HPDOUT_H
LCD_PWREN_H: U?#21.D27(GPIO1_B3_d) ; port LCD_PWREN_H
MAC1_MCINOUT: R?#35.1 U?#20.AE29(GPIO3_B6_d)
MAC1_TXCLK: R?#31.1 U?#20.AD28(GPIO3_A4_d)
MAC1_TXD0: R?#32.1 U?#20.AC28(GPIO3_B3_u)
MAC1_TXD1: R?#33.1 U?#20.AC29(GPIO3_B4_u)
MAC1_TXD2: R?#29.1 U?#20.AA29(GPIO3_A0_u)
MAC1_TXD3: R?#30.1 U?#20.AA30(GPIO3_A1_u)
MAC1_TXEN: R?#34.1 U?#20.AD29(GPIO3_B5_u)
NetR?#36_1: R?#36.1 U?#20.Y30(GPIO3_C3_d)
NetR?#69_1: U?#19.AL27(GPIO4_A6_d) ; port TYPEC0_SBU1_DC
NetR?#72_1: U?#19.AM27(GPIO4_A7_d) ; port TYPEC0_SBU2_DC
NetR?#82_1: U?#19.AL30(GPIO4_A1_d) ; port TYPEC5V_PWREN_H

Not connected (* = marked no-connect by the designer): U?#19 AJ25(GPIO4_C0_u) AJ26(GPIO4_B5_d) AJ27(GPIO4_B6_d) AJ28(GPIO4_B7_u) AK24(GPIO4_C1_d) AK25(GPIO4_B2_u) AK26(GPIO4_B0_d) AK27(GPIO4_A5_d) AK30(GPIO4_A0_d) AL24(GPIO4_B1_u) AL26(GPIO4_B4_u) AL28(GPIO4_A4_d) AL29(GPIO4_A3_d) AM25(GPIO4_B3_u) AM29(GPIO4_A2_d); U?#20 AB28(GPIO3_D5_d) AE28(GPIO3_B2_d) AG26(GPIO3_C6_u) AH24(GPIO3_D0_u) AH25(GPIO3_C5_u) AH26(GPIO3_C4_u) AJ24(GPIO3_C7_u) Y27(GPIO3_C1_d) Y29(GPIO3_C0_d); U?#21 A24(GPIO1_A0_d) A25(GPIO1_A1_d) A26(GPIO1_A2_d) A27(GPIO1_A3_d) B25(GPIO1_A4_d) B26(GPIO1_A5_d) C24(GPIO1_A6_d) C25(GPIO1_A7_u) C27(GPIO1_B0_u) D25(GPIO1_B1_d) D26(GPIO1_B2_d) E24(GPIO1_B4_u) E25(GPIO1_B5_u) E26(GPIO1_B6_u) E27(GPIO1_B7_u) F24(GPIO1_D6_u) F25(GPIO1_D7_u)

### Notes on the sheet
- RK3588_K(VCCIO6 Domain)
- RK3588_J(VCCIO5 Domain)
- RK3588_I(VCCIO4 Domain)
- 420x594
- Формат А2
- (in symbol SOC_RK3588, part I) VCCIO4 Domain; Operating Voltage=1.8V/3.3V; /; SPI4_MISO_M2; PCIE30X1_1_CLKREQN_M2; DP0_HPDIN_M2; I2C2_SDA_M4; UART6_RX_M1; SATA1_ACT_LED_M1; SPI4_MOSI_M2; PCIE30X1_1_WAKEN_M2; DP1_HPDIN_M2; I2C2_SCL_M4; UART6_TX_M1; PWM0_M2; SPI4_CLK_M2; VOP_POST_EMPTY; I2C4_SDA_M3; UART6_RTSN_M1; PWM1_M2; SPI4_CS0_M2; HDMI_TX1_SDA_M2; I2C4_SCL_M3; UART6_CTSN_M1; SPI2_MISO_M0; HDMI_TX1_SCL_M2; SPI2_MOSI_M0; HDMI_TX0_HPD_M0; SPI2_CLK_M0; HDMI_TX1_HPD_M0; PWM3_IR_M3; SPI2_CS0_M0; PCIE30X1_1_PERSTN_M2; PDM1_SDI0_M1; SPI2_CS1_M0; PCIE30X4_CLKREQN_M3; PDM1_SDI1_M1; SPI0_MISO_M2; PCIE30X4_WAKEN_M3; PDM1_SDI2_M1; SPI0_MOSI_M2; PCIE30X4_PERSTN_M3; PDM1_SDI3_M1; UART4_RX_M2; SATA0_ACT_LED_M1; SPI0_CLK_M2; PCIE30X1_0_WAKEN_M2; PDM1_CLK1_M1; UART4_TX_M2; SPI0_CS0_M2; PCIE30X1_0_PERSTN_M2; PDM1_CLK0_M1; UART7_RX_M2; SPI0_CS1_M2; PCIE30X1_0_CLKREQN_M2; UART7_TX_M2; HDMI_RX_HPDOUT_M2; SPDIF0_TX_M0; PCIE30X2_WAKEN_M3; MIPI_CAMERA1_CLK_M0; I2C5_SCL_M3; UART1_TX_M1; SATA2_ACT_LED_M1; HDMI_RX_CEC_M2; PWM13_M2; SPDIF1_TX_M0; PCIE30X2_PERSTN_M3; MIPI_CAMERA2_CLK_M0; I2C5_SDA_M3; UART1_RX_M1; HDMI_RX_SCL_M2; PWM14_M2; MIPI_CAMERA3_CLK_M0; I2C8_SCL_M2; UART1_RTSN_M1; HDMI_RX_SDA_M2; PWM15_IR_M3; PCIE30X2_CLKREQN_M3; MIPI_CAMERA4_CLK_M0; I2C8_SDA_M2; UART1_CTSN_M1
- (in symbol SOC_RK3588, part J) VCCIO5 Domain; Operating Voltage=1.8V/3.3V; PWM10_M0; /; SPI4_MISO_M1; I2C6_SDA_M4; FSPI_D0_M2; I2S3_MCLK; SDIO_D0_M1; GMAC1_TXD2; AUDDSM_LN; SPI4_MOSI_M1; PWM11_IR_M0; I2C6_SCL_M4; FSPI_D1_M2; I2S3_SCLK; SDIO_D1_M1; GMAC1_TXD3; AUDDSM_LP; SPI4_CLK_M1; UART8_TX_M1; FSPI_D2_M2; I2S3_LRCK; SDIO_D2_M1; GMAC1_RXD2; AUDDSM_RN; SPI4_CS0_M1; UART8_RX_M1; FSPI_D3_M2; I2S3_SDO; SDIO_D3_M1; GMAC1_RXD3; AUDDSM_RP; SPI4_CS1_M1; UART8_RTSN_M1; I2S3_SDI; SDIO_CMD_M1; GMAC1_TXCLK; MIPI_CAMERA0_CLK_M1; UART8_CTSN_M1; I2C4_SDA_M0; FSPI_CLK_M2; SDIO_CLK_M1; GMAC1_RXCLK; MIPI_CAMERA1_CLK_M1; I2C4_SCL_M0; ETH1_REFCLKO_25M; PWM8_M0; MIPI_CAMERA2_CLK_M1; GMAC1_RXD0; PWM9_M0; MIPI_CAMERA3_CLK_M1; GMAC1_RXD1; PWM2_M1; MIPI_CAMERA4_CLK_M1; UART2_TX_M2; GMAC1_RXDV_CRS; PWM3_IR_M1; UART2_RX_M2; I2S2_SDI_M1; GMAC1_TXER; UART2_RTSN; I2S2_SDO_M1; GMAC1_TXD0; UART2_CTSN; I2S2_MCLK_M1; GMAC1_TXD1; PWM12_M0; CAN1_RX_M0; UART3_TX_M1; I2S2_SCLK_M1; GMAC1_TXEN; PWM13_M0; CAN1_TX_M0; UART3_RX_M1; I2S2_LRCK_M1; GMAC1_MCLKINOUT; I2C3_SCL_M1; SPI1_MOSI_M1; HDMI_TX1_HPD_M1; GMAC1_PTP_REF_CLK; UART7_TX_M1; I2C3_SDA_M1; SPI1_MISO_M1; GMAC1_PPSTRIG; PCIE30X2_BUTTON_RSTN; UART7_RX_M1; SPI1_CLK_M1; GMAC1_PPSCLK; PWM14_M0; UART7_RTSN_M1; I2C8_SCL_M4; SPI1_CS0_M1; MIPI_TE0; GMAC1_MDC; PWM15_IR_M0; UART7_CTSN_M1; I2C8_SDA_M4; SPI1_CS1_M1; MIPI_TE1; GMAC1_MDIO; CAN2_RX_M0; PCIE30X4_CLKREQN_M2; UART5_TX_M1; FSPI_CS0N_M2; SPI3_CS0_M3; HDMI_TX1_CEC_M2; CIF_D8; CAN2_TX_M0; PCIE30X4_WAKEN_M2; UART5_RX_M1; FSPI_CS1N_M2; SPI3_CS1_M3; HDMI_TX1_SDA_M1; CIF_D9; PCIE30X4_PERSTN_M2; SPI3_MISO_M3; HDMI_TX1_SCL_M1; CIF_D10; PCIE20X1_2_CLKREQN_M0; I2C5_SCL_M0; SPI3_MOSI_M3; HDMI_TX0_SCL_M2; CIF_D11; PWM8_M2; PCIE20X1_2_WAKEN_M0; UART4_RX_M1; I2C5_SDA_M0; SPI3_CLK_M3; HDMI_TX0_SDA_M2; CIF_D12; PWM9_M2; PCIE20X1_2_PERSTN_M0; UART4_TX_M1; SPI0_MISO_M3; HDMI_RX_CEC_M1; CIF_D13; PCIE30X2_CLKREQN_M2; UART9_RTSN_M2; I2C7_SCL_M2; SPI0_MOSI_M3; HDMI_RX_SCL_M1; CIF_D14; PWM10_M2; PCIE30X2_WAKEN_M2; UART9_CTSN_M2; I2C7_SDA_M2; SPI0_CLK_M3; HDMI_RX_SDA_M1; CIF_D15; PCIE30X2_PERSTN_M2; UART9_RX_M2; SPI0_CS0_M3; HDMI_RX_HPDOUT_M1; HDMI_TX0_HPD_M1; MCU_JTAG_TCK_M1; DP1_HPDIN_M0; PWM11_IR_M3; PCIE30X4_BUTTON_RSTN; UART9_TX_M2; SPI0_CS1_M3; MCU_JTAG_TMS_M1
- (in symbol SOC_RK3588, part K) VCCIO6 Domain; Operating Voltage=1.8V/3.3V; /; SPI0_MISO_M1; UART9_RTSN_M1; I2S1_MCLK_M0; PCIE30X1_1_CLKREQN_M1; BT1120_D0; CIF_D0; SPI0_MOSI_M1; UART9_CTSN_M1; I2S1_SCLK_M0; PCIE30X1_1_WAKEN_M1; BT1120_D1; CIF_D1; SPI0_CLK_M1; I2S1_LRCK_M0; PCIE30X1_1_PERSTN_M1; BT1120_D2; CIF_D2; UART0_TX_M2; PCIE30X1_0_CLKREQN_M1; BT1120_D3; CIF_D3; SPI2_MISO_M1; UART0_RX_M2; I2C3_SCL_M2; PCIE30X1_0_WAKEN_M1; BT1120_D4; CIF_D4; SPI2_MOSI_M1; UART3_TX_M2; I2C3_SDA_M2; I2S1_SDI0_M0; PCIE30X1_0_PERSTN_M1; BT1120_D5; CIF_D5; SPI2_CLK_M1; UART3_RX_M2; I2C5_SCL_M2; I2S1_SDI1_M0; PCIE30X2_CLKREQN_M1; BT1120_D6; CIF_D6; SPI2_CS0_M1; I2C5_SDA_M2; I2S1_SDI2_M0; PCIE30X2_WAKEN_M1; BT1120_D7; CIF_D7; SPI2_CS1_M1; UART8_TX_M0; I2C6_SDA_M3; I2S1_SDI3_M0; PCIE30X2_PERSTN_M1; BT1120_CLKOUT; CIF_CLKIN; SATA2_ACT_LED_M0; SPDIF1_TX_M1; SPI0_CS1_M1; UART8_RX_M0; I2C6_SCL_M3; I2S1_SDO0_M0; PCIE30X1_0_BUTTON_RSTN; MIPI_CAMERA0_CLK_M0; CAN1_RX_M1; PWM14_M1; SPI0_CS0_M1; UART8_RTSN_M0; I2C7_SCL_M3; I2S1_SDO1_M0; PCIE30X1_1_BUTTON_RSTN; BT1120_D8; CIF_HREF; CAN1_TX_M1; PWM15_IR_M1; UART8_CTSN_M0; I2C7_SDA_M3; I2S1_SDO2_M0; PCIE20X1_2_BUTTON_RSTN; BT1120_D9; CIF_VSYNC; SPDIF0_TX_M1; PWM11_IR_M1; DP0_HPDIN_M0; UART9_TX_M1; I2S1_SDO3_M0; PCIE30X4_CLKREQN_M1; BT1120_D10; CIF_CLKOUT; SATA1_ACT_LED_M0; PWM12_M1; SPI3_MISO_M1; UART9_RX_M1; HDMI_RX_CEC_M0; PCIE30X4_WAKEN_M1; BT1120_D11; SATA0_ACT_LED_M0; PWM13_M1; SPI3_MOSI_M1; I2C5_SCL_M1; HDMI_RX_HPDOUT_M0; PCIE30X4_PERSTN_M1; BT1120_D12; SPI3_CLK_M1; I2C5_SDA_M1; HDMI_TX0_SCL_M0; PCIE20X1_2_CLKREQN_M1; BT1120_D13; SPI3_CS0_M1; I2C8_SCL_M3; HDMI_TX0_SDA_M0; PCIE20X1_2_WAKEN_M1; BT1120_D14; SPDIF1_TX_M2; PWM6_M1; SPI3_CS1_M1; I2C8_SDA_M3; HDMI_TX0_CEC_M0; PCIE20X1_2_PERSTN_M1; BT1120_D15

### Library data of the parts
C?#77 = CAP NP_Dup1: cap,100.00nF,+/-10%,6.3V,X5R,C0201; Part Reference: C1909; Manufacturer: TDK; RK PN: C0603X5R0J104K030BC; Priority: A; Tolerance: 10%; PCB Footprint: C0201; Value: 100nF; Part Type: C0201; Manufacturer PN: C0603X5R0J104K030BC; Created by: JJJ
C?#78 = CAP NP_Dup1: cap,100.00nF,+/-10%,6.3V,X5R,C0201; Part Reference: C1908; Manufacturer: TDK; RK PN: C0603X5R0J104K030BC; Priority: A; Tolerance: 10%; PCB Footprint: C0201; Value: 100nF; Part Type: C0201; Manufacturer PN: C0603X5R0J104K030BC; Created by: JJJ
C?#79 = CAP NP_Dup1: cap,100.00nF,+/-10%,6.3V,X5R,C0201; Part Reference: C1903; Manufacturer: TDK; RK PN: C0603X5R0J104K030BC; Priority: A; Tolerance: 10%; PCB Footprint: C0201; Value: 100nF; Part Type: C0201; Manufacturer PN: C0603X5R0J104K030BC; Created by: JJJ
C?#80 = CAP NP_Dup1: cap,100.00nF,+/-10%,6.3V,X5R,C0201; Part Reference: C1902; Manufacturer PN: C0603X5R0J104K030BC; Manufacturer: TDK; Tolerance: 10%; Priority: A; PCB Footprint: C0201; Value: 100nF; Created by: JJJ; Part Type: C0201; RK PN: C0603X5R0J104K030BC
C?#81 = CAP NP_Dup1: cap,100.00nF,+/-10%,6.3V,X5R,C0201; Part Reference: C1907; Manufacturer PN: C0603X5R0J104K030BC; Manufacturer: TDK; Tolerance: 10%; Priority: A; PCB Footprint: C0201; Value: 100nF; Created by: JJJ; Part Type: C0201; RK PN: C0603X5R0J104K030BC
R?#29 = RESISTOR_Dup2: НЁУГєсД¤µзЧи,0R,+/-5%,R0402,1/16W.; Part Reference: R1512; Manufacturer: YAGEO; RK PN: RC0402JR-070RL; Priority: A; Wattage: 1/16W; PCB Footprint: R0402; Value: 0R; Part Type: НЁУГєсД¤µзЧи; Manufacturer PN: RC0402JR-070RL; Created by: YTL
R?#30 = RESISTOR_Dup2: НЁУГєсД¤µзЧи,0R,+/-5%,R0402,1/16W.; Part Reference: R1513; Manufacturer PN: RC0402JR-070RL; Manufacturer: YAGEO; Wattage: 1/16W; Priority: A; PCB Footprint: R0402; Value: 0R; Created by: YTL; Part Type: НЁУГєсД¤µзЧи; RK PN: RC0402JR-070RL
R?#31-R?#36 = RESISTOR_Dup2: НЁУГєсД¤µзЧи,0R,+/-5%,R0402,1/16W.; Part Reference: R1514; Manufacturer: YAGEO; RK PN: RC0402JR-070RL; Priority: A; Wattage: 1/16W; PCB Footprint: R0402; Value: 0R; Part Type: НЁУГєсД¤µзЧи; Manufacturer PN: RC0402JR-070RL; Created by: YTL
U?#19-U?#21 = SOC_RK3588: as U?#9-U?#11 on sheet RK3588_BOOTLOADER_MAYBE_SDIO; Value: RK3588; Created by: YWQ; Manufacturer PN: RK3588; Part Type: SOC; RK PN: RK3588; PCB Footprint: BGA1088_23R00X23R00X2R00

## Sheet UART_DEBUG.SchDoc
size 209 x 297 mm; SheetNumber: 12; SheetTotal: 23
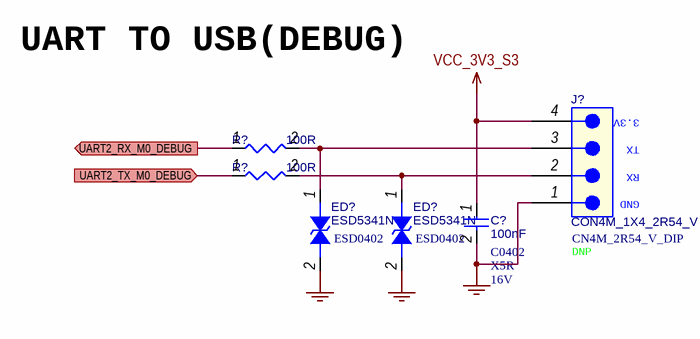
[diagram p13: UART_DEBUG.SchDoc]

### Parts
(Parts that share a designator on the sheet are numbered #1, #2 ... from top to bottom, then left to right.)
C?#82  100nF  Dielectric: X5R  Voltage: 16V  [C0402]
ED?#1  ESD5341N  [ESD0402]
ED?#2  ESD5341N  [ESD0402]
J?#1  CON4M_1X4_2R54_V  OPTION: DNP  [CN4M_2R54_V_DIP]
R?#37  100R  [R0402]
R?#38  100R  [R0402]

### Ports
UART2_RX_M0_DEBUG (out, see RK3588_OSC_PLL[3C]), UART2_TX_M0_DEBUG (in, see RK3588_OSC_PLL[3C])

### Nets
GND: C?#82.2 ED?#1.2 ED?#2.2 J?#1.1
VCC_3V3_S3: C?#82.1 J?#1.4
NetED?#1_1: ED?#1.1 J?#1.3 R?#37.2
NetED?#2_1: ED?#2.1 J?#1.2(RX) R?#38.2
NetR?#37_1: R?#37.1 ; port UART2_RX_M0_DEBUG
NetR?#38_1: R?#38.1 ; port UART2_TX_M0_DEBUG

### Notes on the sheet
- UART TO USB(DEBUG)
- 297x210
- Формат А4
- (in symbol HEADER 4_2) 3.3V; TX; GND

### Library data of the parts
C?#82 = CAP NP_Dup1: cap,100.00nF,+/-10%,16V,X5R,C0402; Part Reference: C9300; Manufacturer PN: C1005X5R1C104K050BA; Manufacturer: TDK; Tolerance: 10%; Priority: A; PCB Footprint: C0402; Value: 100nF; Created by: JJJ; Part Type: C0402; RK PN: C1005X5R1C104K050BA
ED?#1 = DIODE BI_DIR TRIG: 1-Line, Bi-directional, Transient Voltage Suppressors.1pF.; Part Reference: ED9300; Manufacturer: WillSemi(О¤¶ы°лµјМе); Priority: A; PCB Footprint: ESD0402; Value: ESD5341N; Created by: JJJ; Manufacturer PN: ESD5341N; Part Type: ESD_TVS; RK PN: ESD5341N
ED?#2 = DIODE BI_DIR TRIG: 1-Line, Bi-directional, Transient Voltage Suppressors.1pF.; Part Reference: ED9301; Manufacturer: WillSemi(О¤¶ы°лµјМе); Priority: A; PCB Footprint: ESD0402; Value: ESD5341N; Created by: JJJ; Manufacturer PN: ESD5341N; Part Type: ESD_TVS; RK PN: ESD5341N
J?#1 = HEADER 4_2: Part Reference: J9300; Value: CON4M_1X4_2R54_V; PCB Footprint: CN4M_2R54_V_DIP
R?#37 = RESISTOR_Dup2: НЁУГєсД¤µзЧи,100R,+/-5%,R0402,1/16W.; Part Reference: R9300; Manufacturer: YAGEO; RK PN: RC0402JR-07100RL; Priority: A; Wattage: 1/16W; Value: 100R; Part Type: НЁУГєсД¤µзЧи; Manufacturer PN: RC0402JR-07100RL; Created by: YTL
R?#38 = RESISTOR_Dup2: НЁУГєсД¤µзЧи,100R,+/-5%,R0402,1/16W.; Part Reference: R9301; Manufacturer PN: RC0402JR-07100RL; Manufacturer: YAGEO; Wattage: 1/16W; Priority: A; Value: 100R; Created by: YTL; Part Type: НЁУГєсД¤µзЧи; RK PN: RC0402JR-07100RL

## Sheet POWER_IN_TYPE_C.SchDoc
size 209 x 297 mm; SheetNumber: 13; SheetTotal: 23
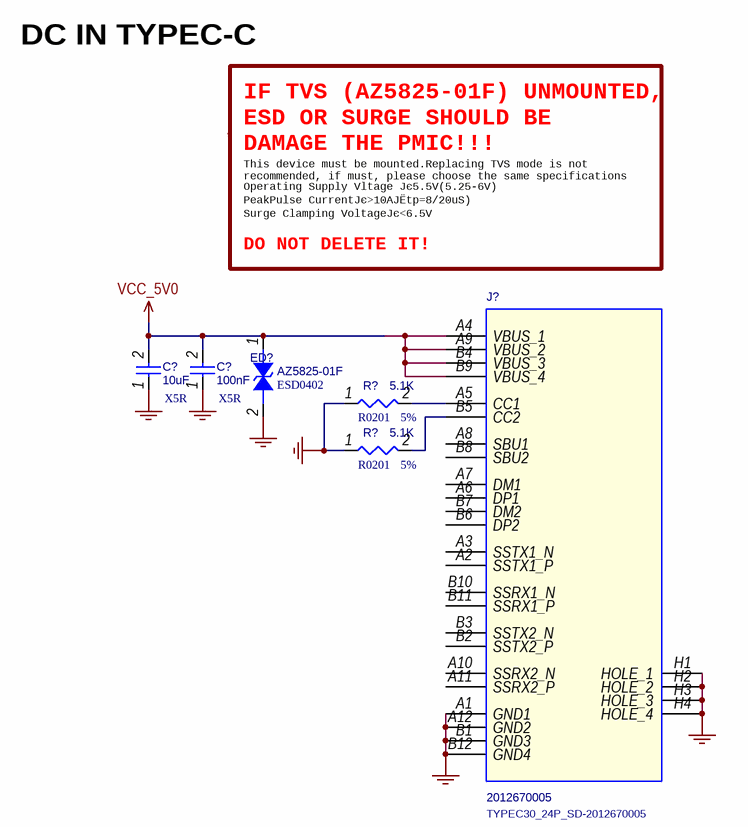
[diagram p14: POWER_IN_TYPE_C.SchDoc]

### Parts
(Parts that share a designator on the sheet are numbered #1, #2 ... from top to bottom, then left to right.)
C?#83  10uF  Dielectric: X5R  [C0201]
C?#84  100nF  Dielectric: X5R  [C0201]
ED?#3  AZ5825-01F  [ESD0402]
J?#2  2012670005  [TYPEC30_24P_SD-2012670005]
R?#39  5.1K  Tolerance: 5%  PCB Footprint: R0201  [R0402]
R?#40  5.1K  Tolerance: 5%  PCB Footprint: R0201  [R0402]

### Nets
GND: C?#83.1 C?#84.1 ED?#3.2 J?#2.A1(GND1) J?#2.A12(GND2) J?#2.B1(GND3) J?#2.B12(GND4) J?#2.H1(HOLE_1) J?#2.H2(HOLE_2) J?#2.H3(HOLE_3) J?#2.H4(HOLE_4) R?#39.1 R?#40.1
VCC_5V0: C?#83.2 C?#84.2 ED?#3.1 J?#2.A4(VBUS_1) J?#2.A9(VBUS_2) J?#2.B4(VBUS_3) J?#2.B9(VBUS_4)
NetJ?#2_A5: J?#2.A5(CC1) R?#39.2
NetJ?#2_B5: J?#2.B5(CC2) R?#40.2

Not connected (* = marked no-connect by the designer): J?#2 A2(SSTX1_P) A3(SSTX1_N) A6(DP1) A7(DM1) A8(SBU1) A10(SSRX2_N) A11(SSRX2_P) B2(SSTX2_P) B3(SSTX2_N) B6(DP2) B7(DM2) B8(SBU2) B10(SSRX1_N) B11(SSRX1_P)

### Notes on the sheet
- DC IN TYPEC-C
- Operating Supply Vltage Јє5.5V(5.25-6V)
- PeakPulse CurrentЈє>10AЈЁtp=8/20uS)
- This device must be mounted.Replacing TVS mode is not
  recommended, if must, please choose the same specifications
- IF TVS (AZ5825-01F) UNMOUNTED,
  ESD OR SURGE SHOULD BE
  DAMAGE THE PMIC!!!
- Surge Clamping VoltageЈє<6.5V
- DO NOT DELETE IT!
- 297x210
- Формат А4

### Library data of the parts
C?#83 = CAP NP_Dup1: cap,10.00uF,+/-10%; Part Reference: C2600; Manufacturer: TDK; RK PN: C0603X5R0J104K030BC; Priority: A; Tolerance: 10%; Value: 10uF; Part Type: C0201; Manufacturer PN: C0603X5R0J104K030BC; Created by: JJJ
C?#84 = CAP NP_Dup1: cap,100.00nF,+/-10%; Part Reference: C2600; Manufacturer: TDK; RK PN: C0603X5R0J104K030BC; Priority: A; Tolerance: 10%; Value: 100nF; Part Type: C0201; Manufacturer PN: C0603X5R0J104K030BC; Created by: JJJ
ED?#3 = DIODE BI_DIR TRIG: Transient Voltage Suppressing Device.Tiny Packge for ESD/Transient Protection; Part Reference: ED2200; Manufacturer: AmazingЈЁѕ§мНїЖјјЈ©; Priority: A; PCB Footprint: ESD0402; Value: AZ5825-01F; RK PN: AZ5825-01F; Part Type: ESD_TVS; Manufacturer PN: AZ5825-01F; Created by: JJJ
J?#2 = USB31_TYPE_C_24P: USB Type-CОФКЅДёЧщ,МщєёЈ¬USB3.1ЅУїЪ; Part Reference: J2600; Manufacturer: MOLEX; RK PN: SD-105450-001; Priority: A; PCB Footprint: TYPEC30_24P_SD-2012670005; Value: 2012670005; Part Type: USB Jack; Manufacturer Part Number: SD-105450-001; Created by: YWQ
R?#39 R?#40 = RESISTOR_Dup2: НЁУГєсД¤µзЧи,0R,+/-5%,R0201,1/20W.; Part Reference: R2609; Manufacturer PN: RC0201JR-070RL; Manufacturer: YAGEO; Wattage: 1/20W; Priority: A; Value: 5.1K; Created by: YTL; Part Type: НЁУГєсД¤µзЧи; RK PN: RC0201JR-070RL

## Sheet POWER_RK806.SchDoc
size 840 x 594 mm; SheetNumber: 14; SheetTotal: 23
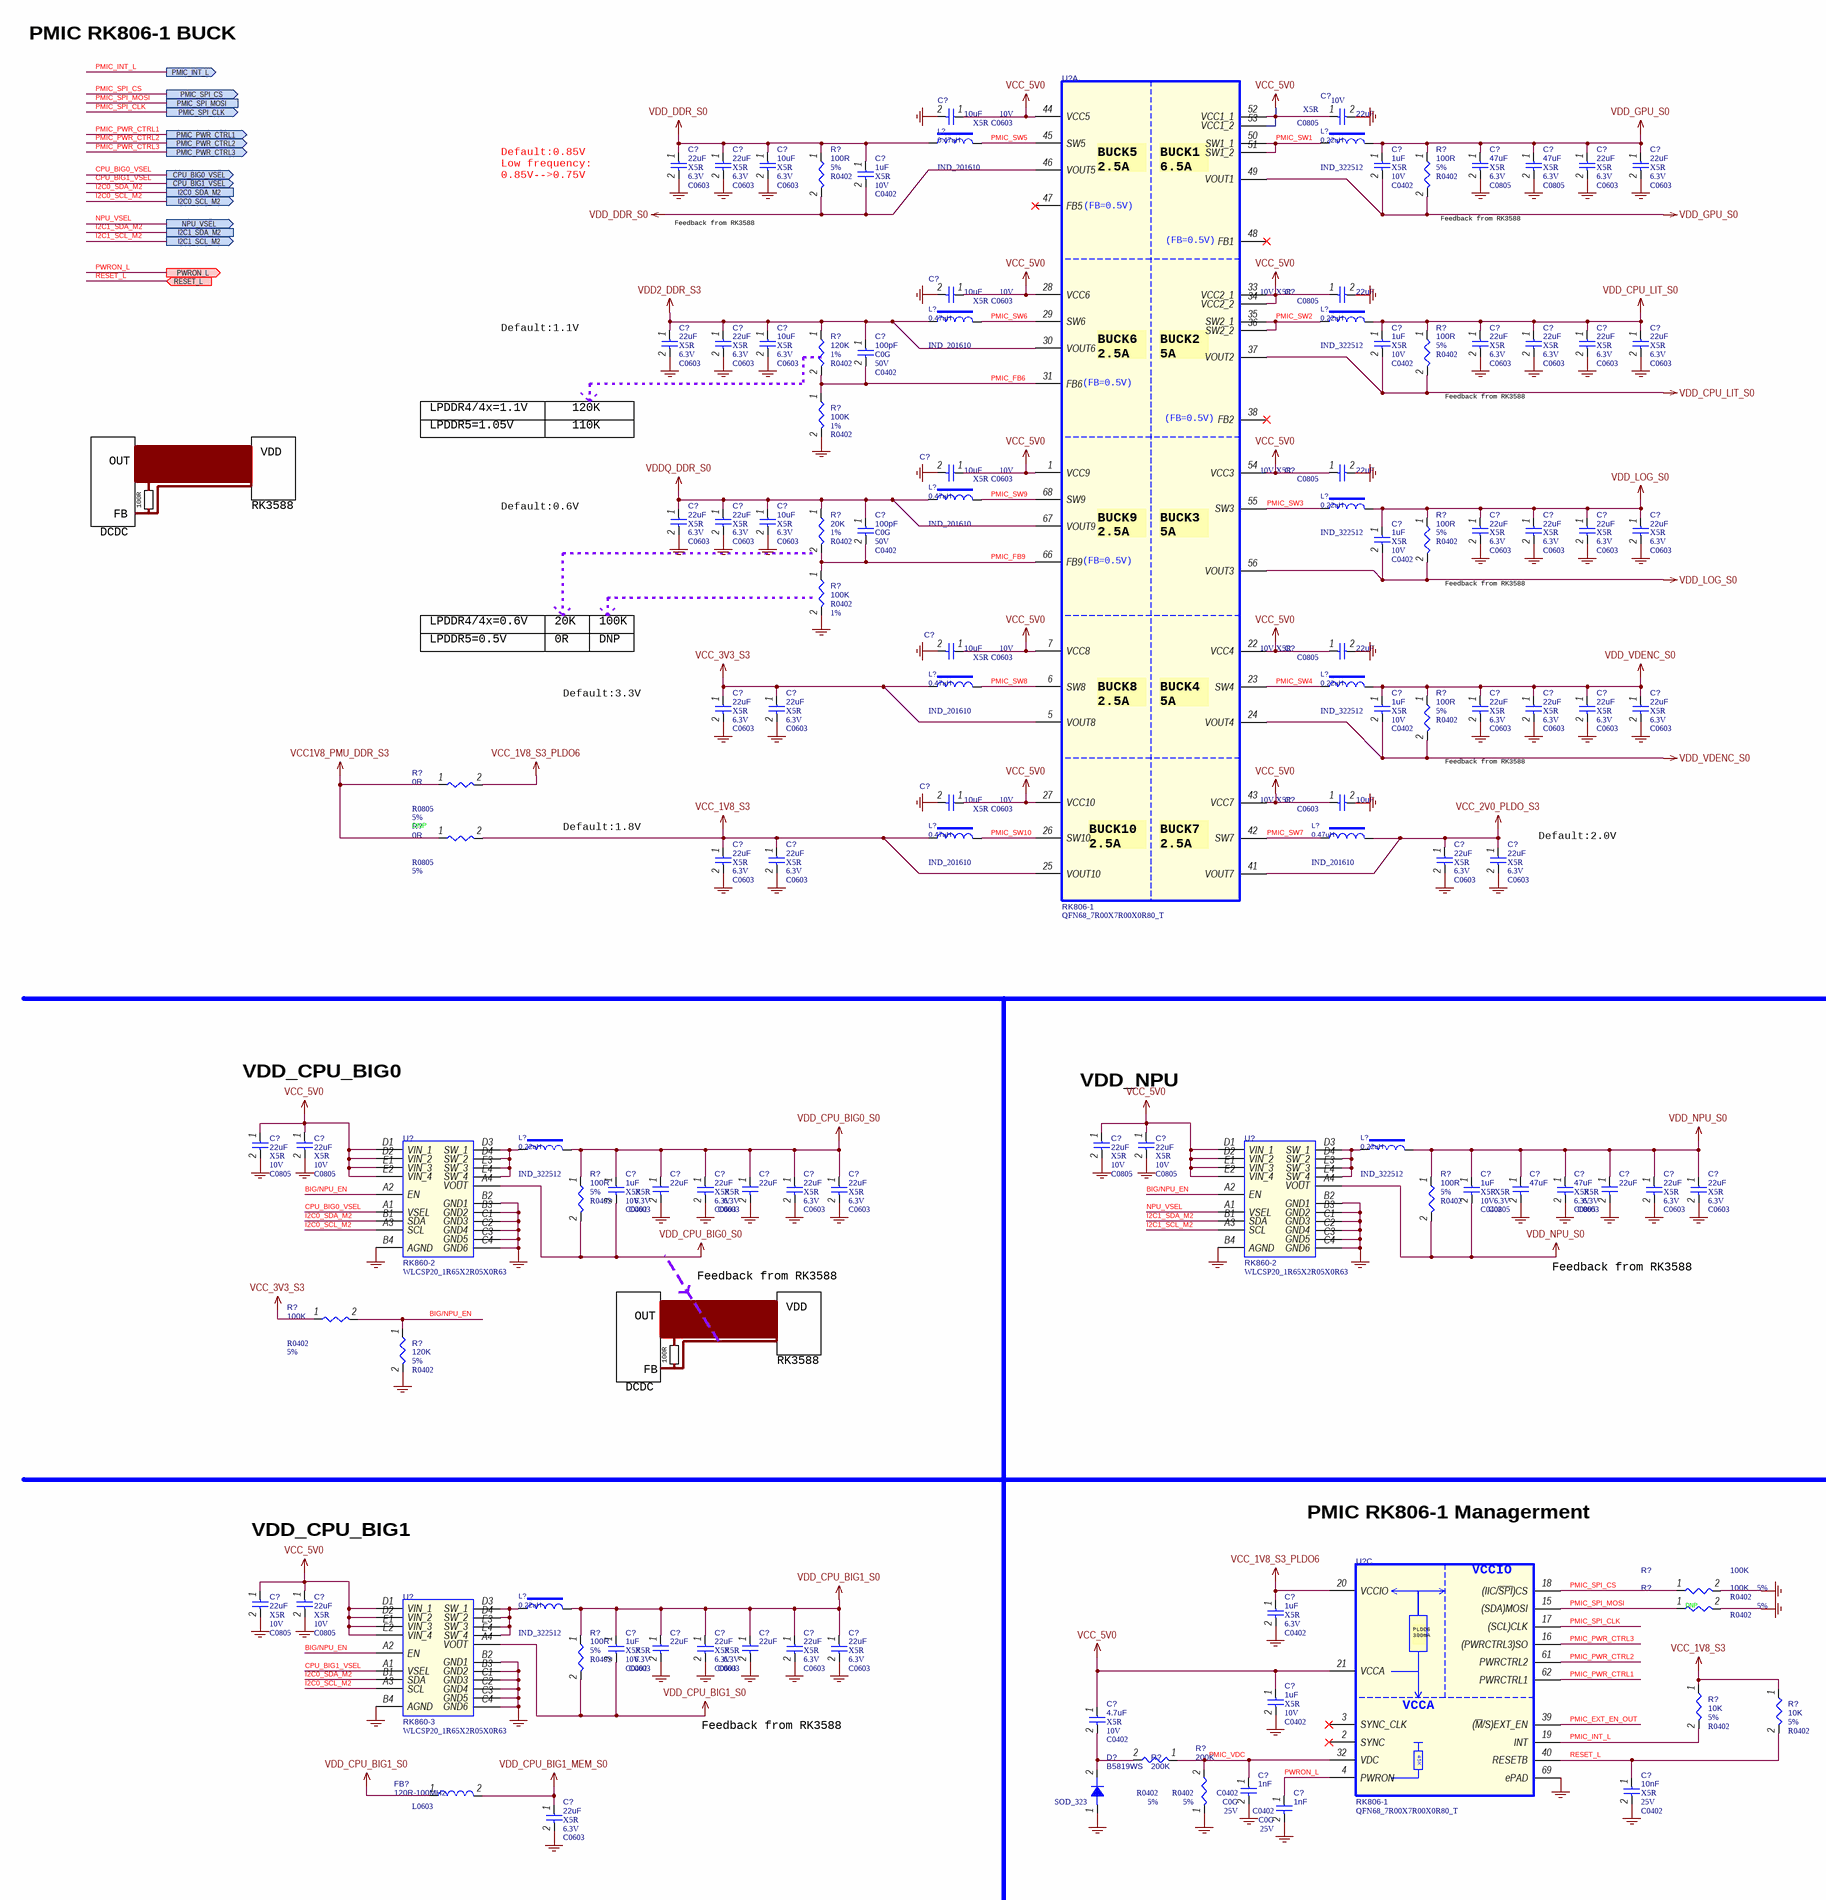
[diagram p15: POWER_RK806.SchDoc, left]
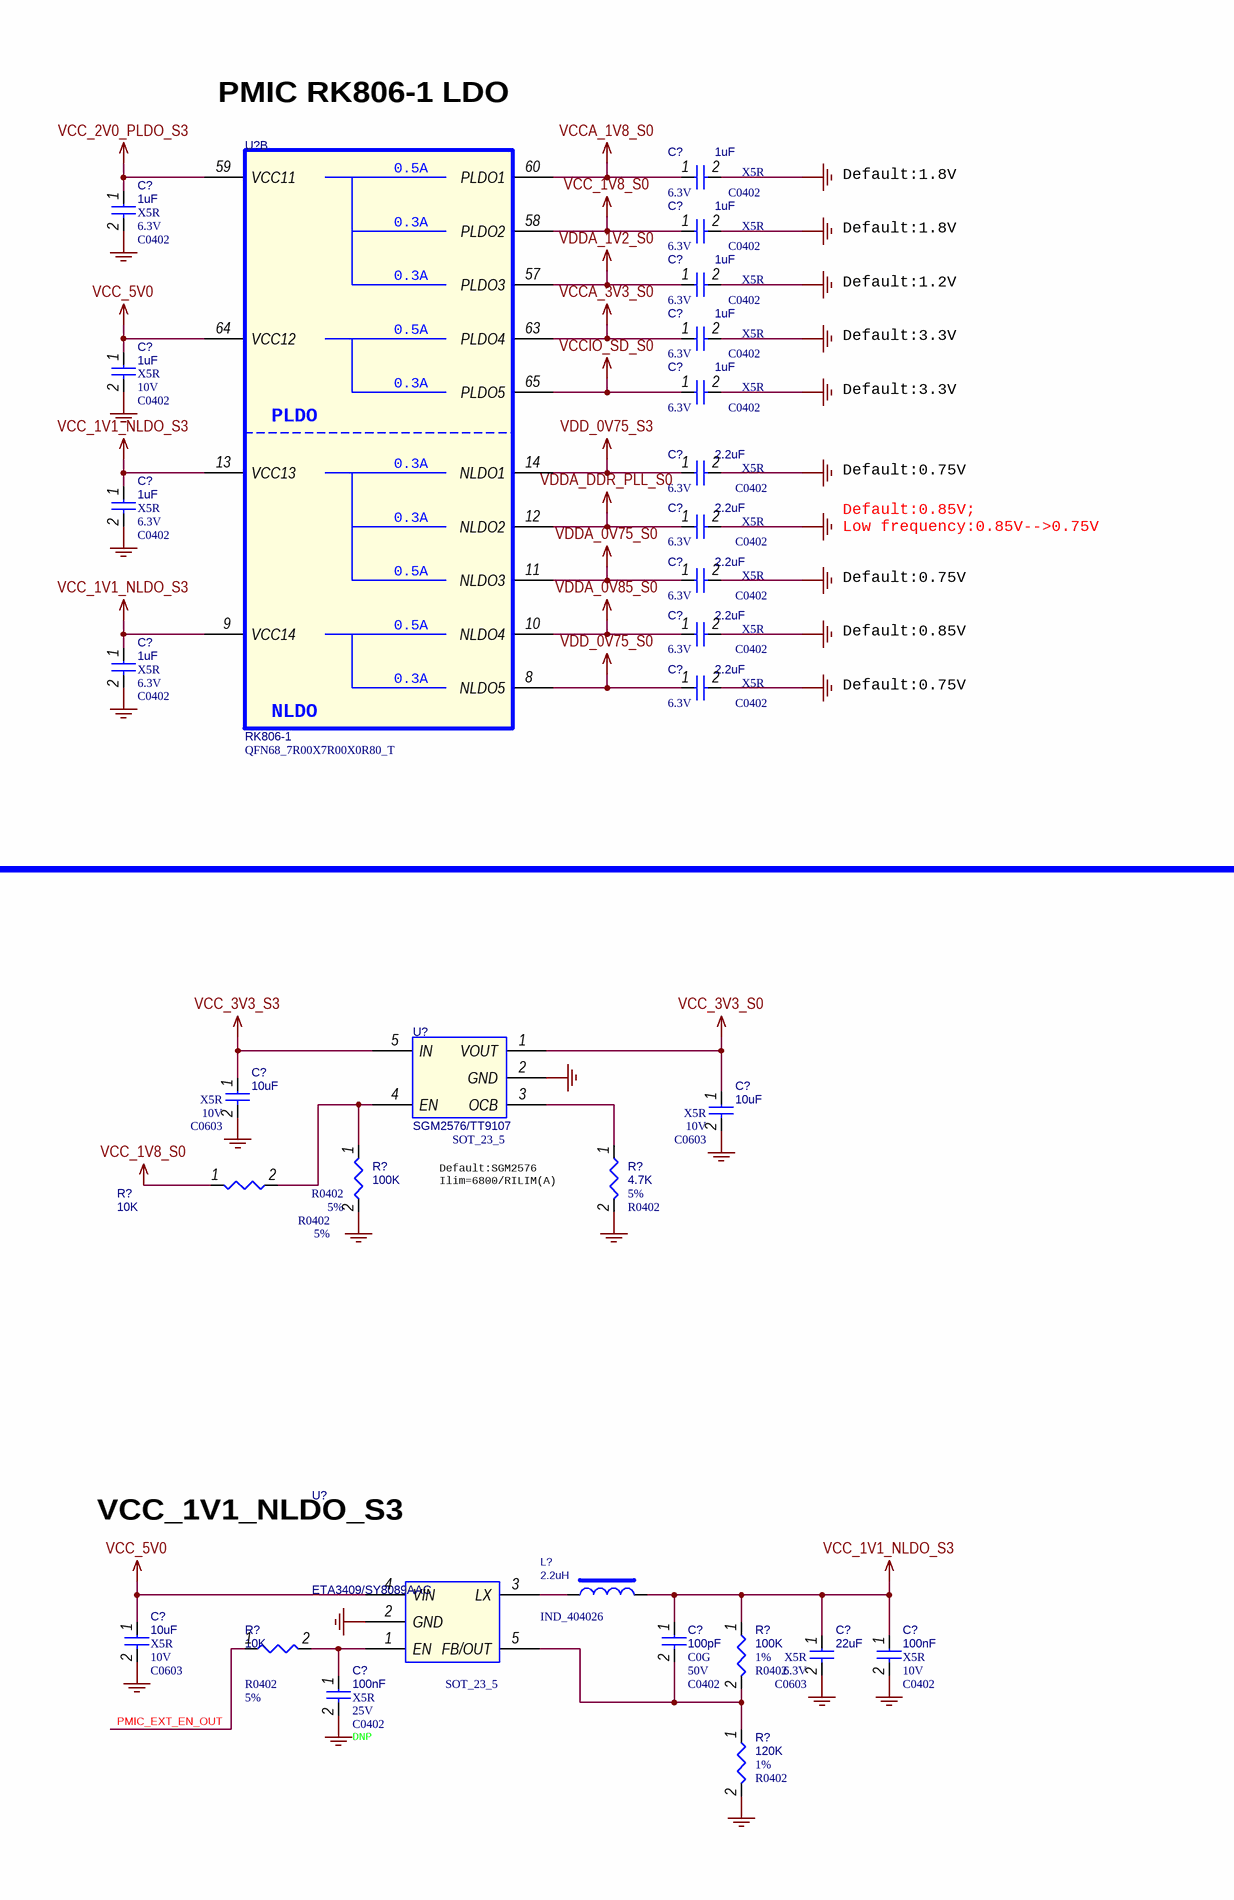
[diagram p16: POWER_RK806.SchDoc, right]